# Altium project LED_MAT_3.PRJPCB (part 1 of 2)
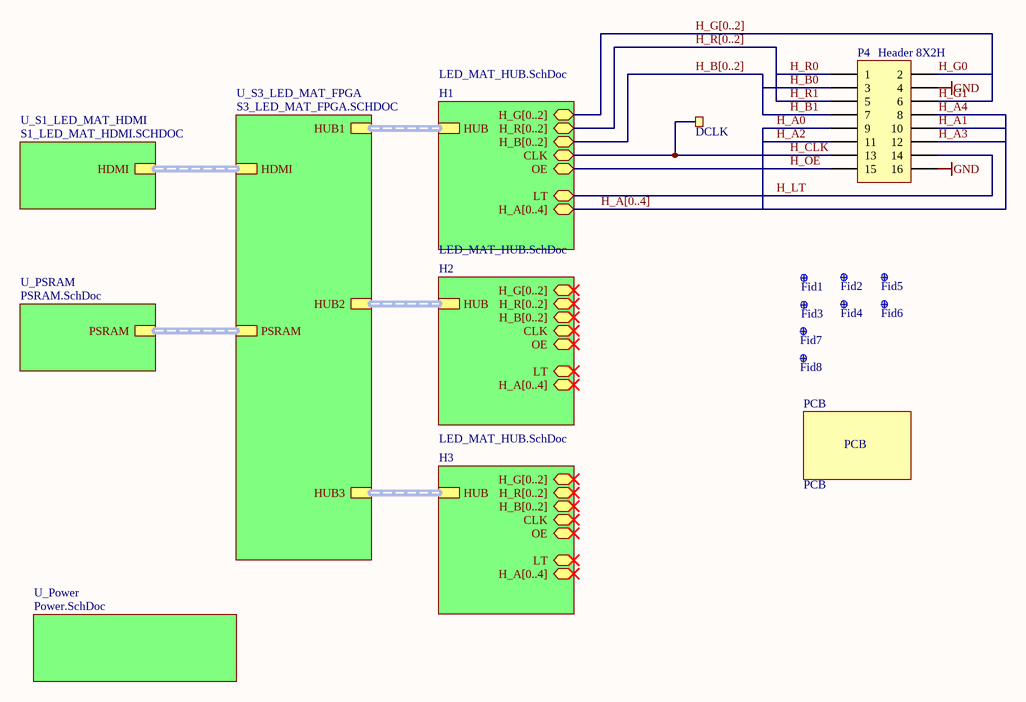
[diagram p0: Top.SchDoc]
ProjectName: LED_MAT3; Revision: 2.0
7 sheets, 230 parts. Net scope: hierarchical (ports join the sheet entries above them; power ports are global).
Board files: LED_MAT.PcbDoc, Panel for LED_MAT-20180829-1100.PcbDoc
Sheets:
  Top.SchDoc
    H1 = LED_MAT_HUB.SchDoc
    U_S3_LED_MAT_FPGA = S3_LED_MAT_FPGA.SCHDOC
      U_S3_LED_MAT_FPGA_POWER = S3_LED_MAT_FPGA_POWER.SchDoc
    U_S1_LED_MAT_HDMI = S1_LED_MAT_HDMI.SCHDOC
    H2 = LED_MAT_HUB.SchDoc
    H3 = LED_MAT_HUB.SchDoc
    U_Power = Power.SchDoc
    U_PSRAM = PSRAM.SchDoc

## Sheet Top.SchDoc: Top Connections
size A4; Revision: 2.0; SheetNumber: 1; SheetTotal: 7; DrawnBy: KSN; Engineer: Dim Su; ContentRev1: Original Document; dateREV1: "Aug/08/2018"; NameRev1: V1; NameRev2: V2; dateREV2: "Sep/03/2018"; ContentRev2: Test pin added; Rev1: V1; Rev2: V2; Project: LED_MAT_3

### Parts
DCLK  Ø1.0mm,SMD  [TP_SMD_1MM]  (value not drawn)  (no BOM)
Fid1  Fiducial mark  [Pass-marke-02]  (value not drawn)  (no BOM)
Fid2  Fiducial mark  [Pass-marke-02]  (value not drawn)  (no BOM)
Fid3  Fiducial mark  [Pass-marke-02]  (value not drawn)  (no BOM)
Fid4  Fiducial mark  [Pass-marke-02]  (value not drawn)  (no BOM)
Fid5  Fiducial mark  [Pass-marke-02]  (value not drawn)  (no BOM)
Fid6  Fiducial mark  [Pass-marke-02]  (value not drawn)  (no BOM)
Fid7  Fiducial mark  [Pass-marke-02]  (value not drawn)  (no BOM)
Fid8  Fiducial mark  [Pass-marke-02]  (value not drawn)  (no BOM)
P4  Header 8X2H  [HDR2X8H]
PCB  PCB  (mechanical)

### Sub-sheets
H1 = LED_MAT_HUB.SchDoc: HUB (harness HUB), H_B[0..2] (bidir), H_G[0..2] (bidir), H_R[0..2] (bidir), H_A[0..4] (bidir), CLK (bidir), OE (bidir), LT (bidir)
H2 = LED_MAT_HUB.SchDoc: HUB (harness HUB), H_B[0..2] (bidir), H_G[0..2] (bidir), H_R[0..2] (bidir), H_A[0..4] (bidir), CLK (bidir), OE (bidir), LT (bidir)
H3 = LED_MAT_HUB.SchDoc: HUB (harness HUB), H_B[0..2] (bidir), H_G[0..2] (bidir), H_R[0..2] (bidir), H_A[0..4] (bidir), CLK (bidir), OE (bidir), LT (bidir)
U_Power = Power.SchDoc: no entries
U_PSRAM = PSRAM.SchDoc: PSRAM (harness PSRAM)
U_S1_LED_MAT_HDMI = S1_LED_MAT_HDMI.SCHDOC: HDMI (harness HDMI)
U_S3_LED_MAT_FPGA = S3_LED_MAT_FPGA.SCHDOC: HUB2 (harness HUB), HUB1 (harness HUB), HUB3 (harness HUB), HDMI (harness HDMI), PSRAM (harness PSRAM)

### Nets
GND: P4.4 P4.16
H_A0: P4.9
H_A1: P4.10
H_A2: P4.11
H_A3: P4.12
H_A4: P4.8
H_B0: P4.3
H_B1: P4.7
H_CLK: DCLK.1 P4.13 ; sheet H1/CLK
H_G0: P4.2
H_G1: P4.6
H_LT: P4.14 ; sheet H1/LT
H_OE: P4.15 ; sheet H1/OE
H_R0: P4.1
H_R1: P4.5

### Buses and harness runs
bus H_A[0..4] = sheet H1/H_A[0..4]
bus H_B[0..2] = sheet H1/H_B[0..2]
bus H_G[0..2] = sheet H1/H_G[0..2]
bus H_R[0..2] = sheet H1/H_R[0..2]
harness sheet H1/HUB = sheet U_S3_LED_MAT_FPGA/HUB1
harness sheet H2/HUB = sheet U_S3_LED_MAT_FPGA/HUB2
harness sheet H3/HUB = sheet U_S3_LED_MAT_FPGA/HUB3
harness sheet U_PSRAM/PSRAM = sheet U_S3_LED_MAT_FPGA/PSRAM
harness sheet U_S1_LED_MAT_HDMI/HDMI = sheet U_S3_LED_MAT_FPGA/HDMI

### Notes on the sheet
- Title
- Size:
- Date:
- A4
- Number:
- Time:
- Revision:
- Sheet
- of
- File:

### Library data of the parts
DCLK = TESTPAD_SMD: circular SMD testpad 1mm; Manufacturer Part Number: *; Value: Ø1.0mm,SMD; Supplier: *; Category: Pattern
Fid1-Fid8 = Fiducial: Value: FM; Remarks: Pattern; Manufacturer: *; Manufacturer Part Number: *; Supplier: *; Category: Pattern; Price: 0; Temperature: ./.
P4 = Header 8X2H: Header, 8-Pin, Dual row, Right Angle; CompName: Connector; Price: .5
PCB = PCB: PNEC_Bridge_v1 PCB/FR4/1.55mm/8L/ENIG; Manufacturer: ./.; Value: 70x127.5x1.6mm 6 Layers; Category: PCB; Manufacturer Part Number: ./.; Package: 70x127.5x1.6mm 6 Layers; Price: 60; Remarks: ./.; Supplier: ./.; Supplier Order Code: ./.; Temperature: ./.; Tolerance: ./.; Type: 70x127.5x1.6mm 6 Layers; Voltage: ./.

## Sheet LED_MAT_HUB.SchDoc: HUB
size A4; Revision: 2.0; SheetNumber: 5; SheetTotal: 7; Engineer: Dim Su; ContentRev1: Original Document; dateREV1: "Aug/08/2018"; dateREV2: "Sep/03/2018"; ContentRev2: No changes; Rev1: V1; Rev2: V2; Project: LED_MAT_3
Used 3 times, as channels H1, H2, H3. Parts and nets are listed once, with the designators drawn on the sheet.
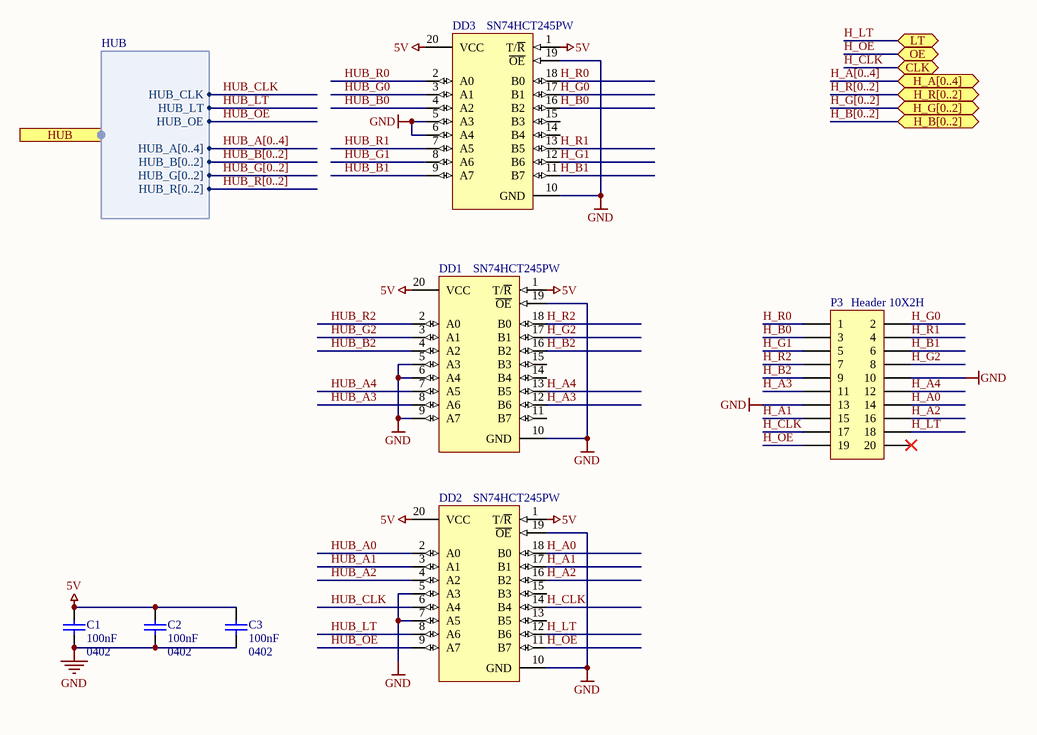
[diagram p1: LED_MAT_HUB.SchDoc]

### Parts
C1  value 100nF  Package: 0402  [CAPC1005L]  (hidden comment: 100nF / 0402 / X7R / 16V)
C2  value 100nF  Package: 0402  [CAPC1005L]  (hidden comment: 100nF / 0402 / X7R / 16V)
C3  value 100nF  Package: 0402  [CAPC1005L]  (hidden comment: 100nF / 0402 / X7R / 16V)
DD1  SN74HCT245PW  [PW020_N]
DD2  SN74HCT245PW  [PW020_N]
DD3  SN74HCT245PW  [PW020_N]
P3  Header 10X2H  [HDR2X10H]

### Ports
CLK (bidir), H_A[0..4] (bidir), H_B[0..2] (bidir), H_G[0..2] (bidir), H_R[0..2] (bidir), HUB (harness HUB), LT (bidir), OE (bidir)

### Harnesses
HUB: HUB_R[0..2], HUB_G[0..2], HUB_B[0..2], HUB_A[0..4], HUB_OE, HUB_LT, HUB_CLK

### Nets
5V: C1.2 C2.2 C3.2 DD1.1(T/~{R}) DD1.20(VCC) DD2.1(T/~{R}) DD2.20(VCC) DD3.1(T/~{R}) DD3.20(VCC)
GND: C1.1 C2.1 C3.1 DD1.5(A3) DD1.6(A4) DD1.9(A7) DD1.10(GND) DD1.19(~{OE}) DD2.5(A3) DD2.7(A5) DD2.10(GND) DD2.19(~{OE}) DD3.5(A3) DD3.6(A4) DD3.10(GND) DD3.19(~{OE}) P3.10 P3.13
H_A0: DD2.18(B0) P3.14
H_A1: DD2.17(B1) P3.15
H_A2: DD2.16(B2) P3.16
H_A3: DD1.12(B6) P3.11
H_A4: DD1.13(B5) P3.12
H_B0: DD3.16(B2) P3.3
H_B1: DD3.11(B7) P3.6
H_B2: DD1.16(B2) P3.9
H_CLK: DD2.14(B4) P3.17 ; port CLK
H_G0: DD3.17(B1) P3.2
H_G1: DD3.12(B6) P3.5
H_G2: DD1.17(B1) P3.8
H_LT: DD2.12(B6) P3.18 ; port LT
H_OE: DD2.11(B7) P3.19 ; port OE
H_R0: DD3.18(B0) P3.1
H_R1: DD3.13(B5) P3.4
H_R2: DD1.18(B0) P3.7
HUB_A0: DD2.2(A0)
HUB_A1: DD2.3(A1)
HUB_A2: DD2.4(A2)
HUB_A3: DD1.8(A6)
HUB_A4: DD1.7(A5)
HUB_B0: DD3.4(A2)
HUB_B1: DD3.9(A7)
HUB_B2: DD1.4(A2)
HUB_CLK: DD2.6(A4) ; port HUB.HUB_CLK
HUB_G0: DD3.3(A1)
HUB_G1: DD3.8(A6)
HUB_G2: DD1.3(A1)
HUB_LT: DD2.8(A6) ; port HUB.HUB_LT
HUB_OE: DD2.9(A7) ; port HUB.HUB_OE
HUB_R0: DD3.2(A0)
HUB_R1: DD3.7(A5)
HUB_R2: DD1.2(A0)

Not connected (* = marked no-connect by the designer): DD1 11(B7) 14(B4) 15(B3); DD2 13(B5) 15(B3); DD3 14(B4) 15(B3); P3 20*

### Channels
H1: designators end in _1; ports CLK=H_CLK LT=H_LT OE=H_OE
H2: designators end in _2; ports CLK=H_CLK_H2 LT=H_LT_H2 OE=H_OE_H2
H3: designators end in _3; ports CLK=H_CLK_H3 LT=H_LT_H3 OE=H_OE_H3

### Buses and harness runs
bus H_A[0..4] = port H_A[0..4]
bus H_B[0..2] = port H_B[0..2]
bus H_G[0..2] = port H_G[0..2]
bus H_R[0..2] = port H_R[0..2]
bus HUB_A[0..4]
bus HUB_B[0..2]
bus HUB_G[0..2]
bus HUB_R[0..2]

### Notes on the sheet
- Title
- Size:
- Date:
- A4
- Number:
- Time:
- Revision:
- Sheet
- of
- File:

### Library data of the parts
C1-C3 = 100nF / 0402 / X7R / 16V: Capacitor ceramic; Manufacturer: SAMSUNG; Manufacturer Part Number: CL05B104KO5NNNC; Voltage: 16V; CompName: Capacitor; Price: 0.2
DD1-DD3 = SN74HCT245PW: Octal 3-State Noninverting Bus Transceiver; Manufacturer: NEXPERIA; CompName: IC; Temperature: -55°C - 125°C; Package: SO-20; Manufacturer Part Number: SN74HCT245PW; Price: 3.14
P3 = Header 10X2H: Header, 10-Pin, Dual row, Right Angle; CompName: Connector; Price: .5

## Sheet S3_LED_MAT_FPGA.SCHDOC: FPGA
size A2; Date: "Day, Month  DD, YYYY"; DrawnBy: KSN; Engineer: Dim Su; Revision: 2.0; SheetNumber: 3; SheetTotal: 7; ContentRev1: Original Document; dateREV1: "Aug/08/2018"; dateREV2: "Sep/03/2018"; ContentRev2: C30, SW1 added; Rev1: V1; Rev2: V2; Project: LED_MAT_3
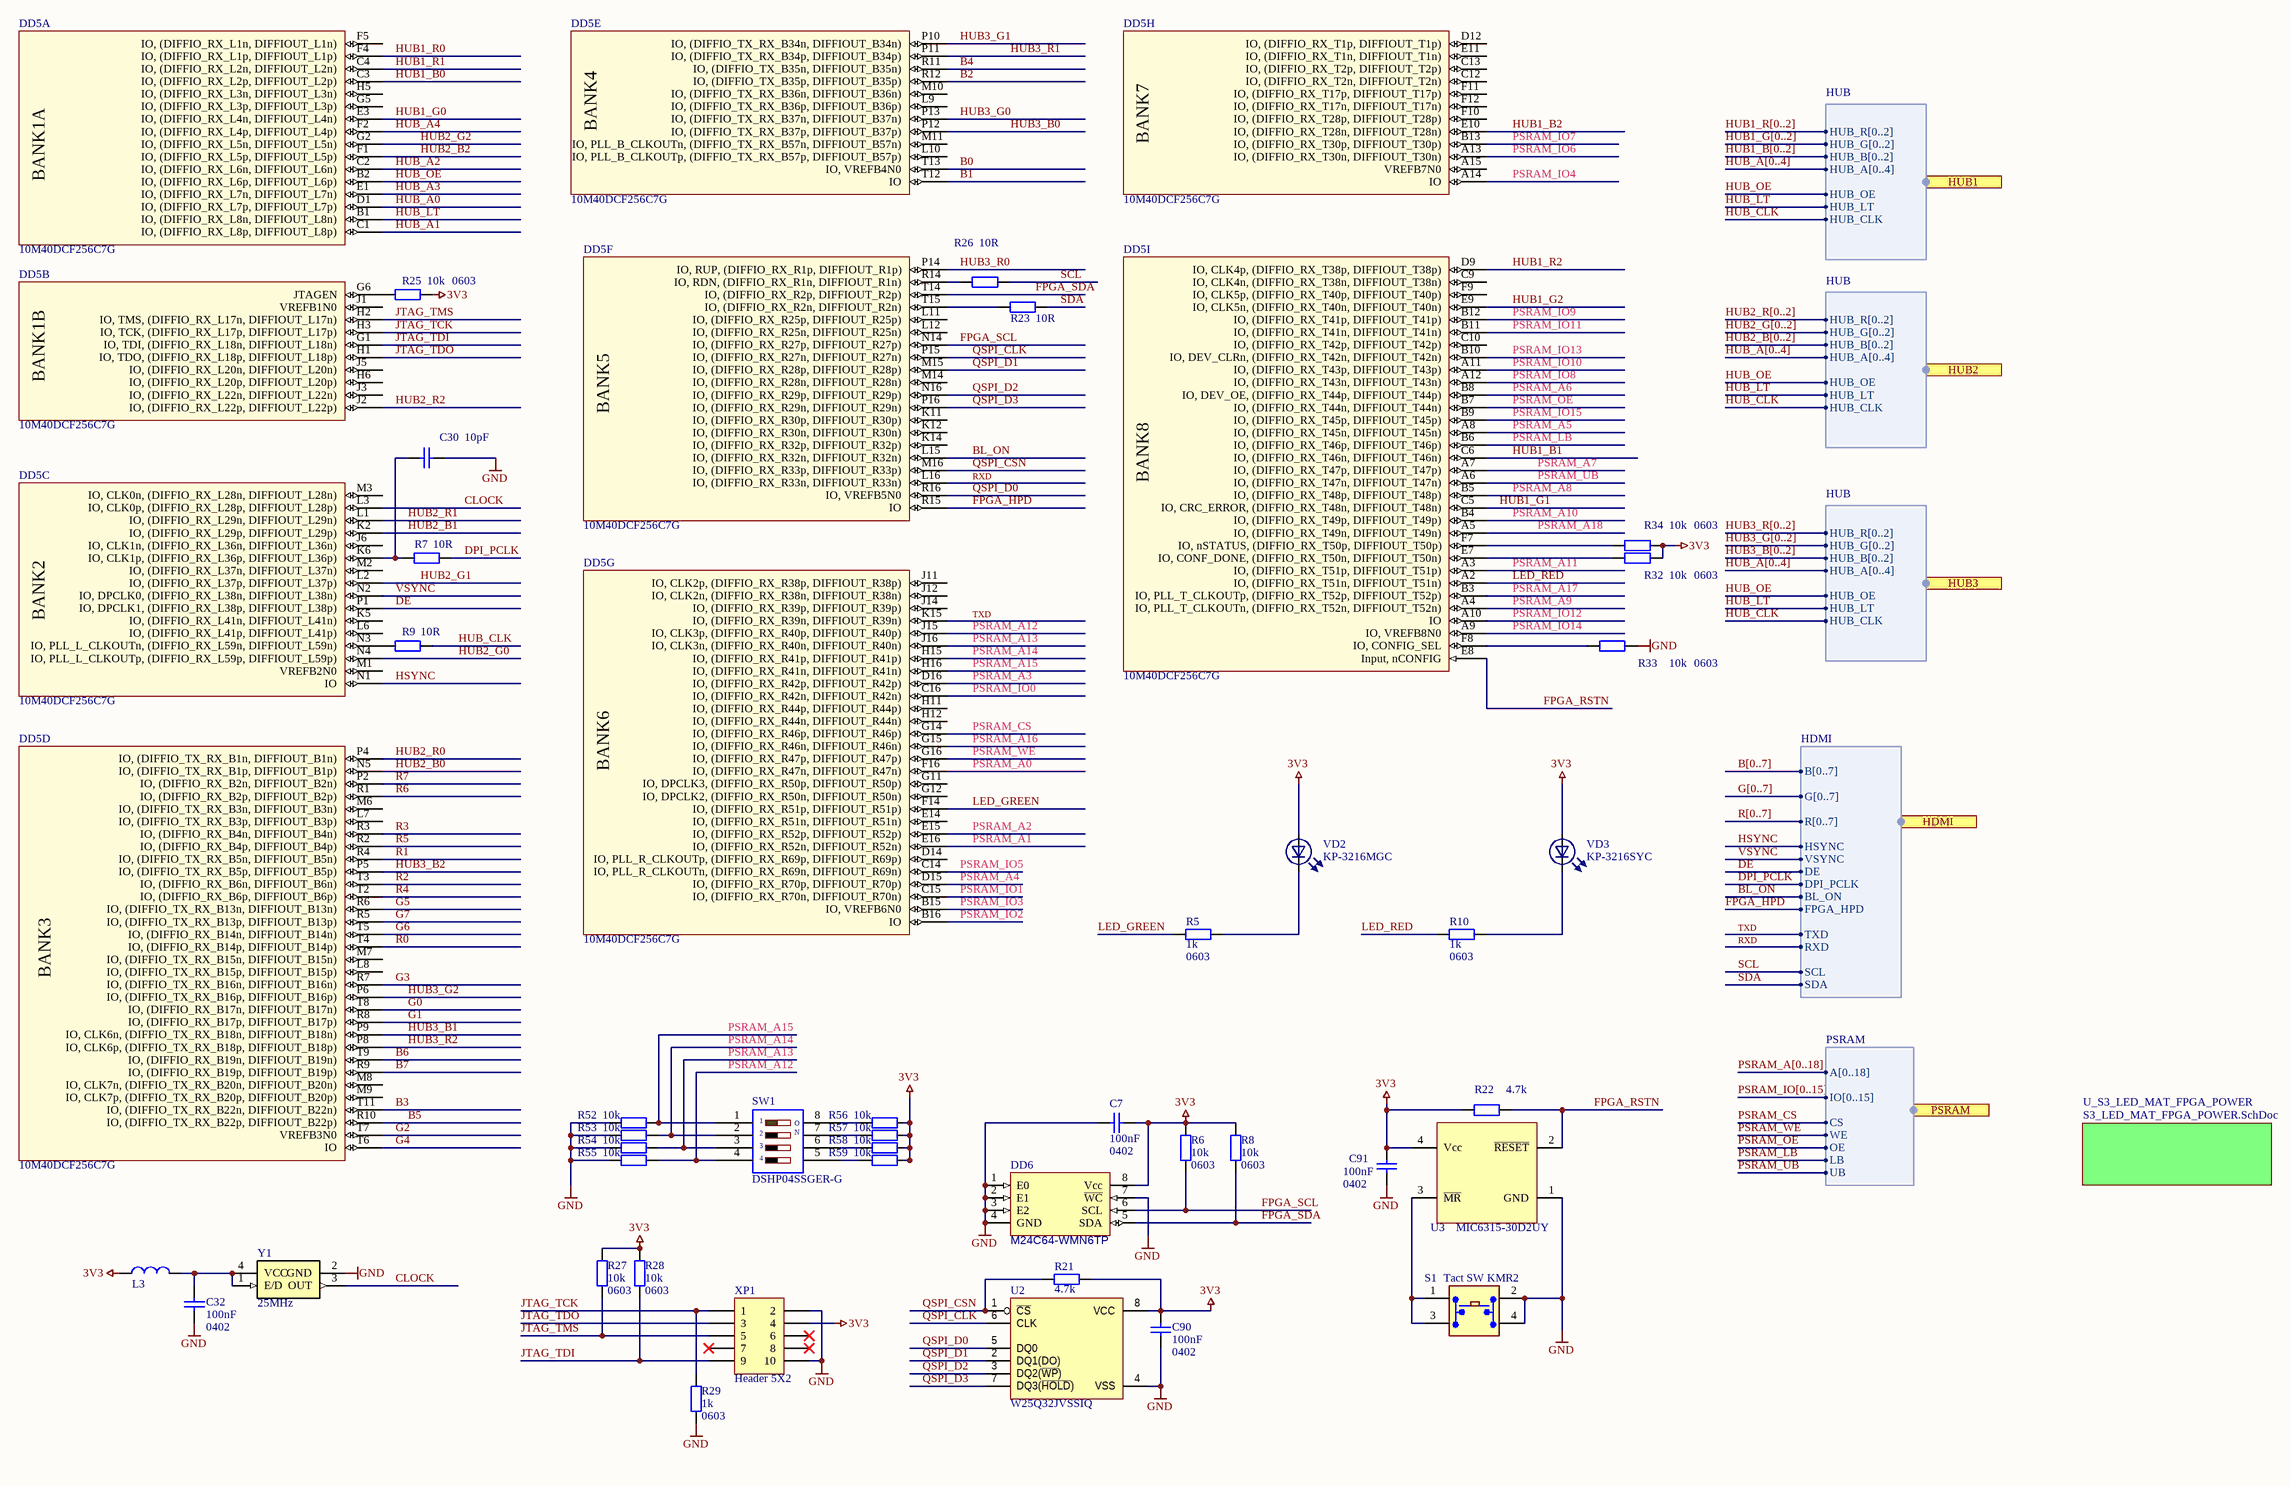
[diagram p2: S3_LED_MAT_FPGA.SCHDOC]

### Parts
C7  value 100nF  Package: 0402  [CAPC1005L]  (hidden comment: 100nF / 0402 / X7R / 16V)
C30  value 10pF  [CAPC1608L]  (hidden comment: 10pF / 0603 / COG / 50V)
C32  value 100nF  Package: 0402  [CAPC1005L]  (hidden comment: 100nF / 0402 / X7R / 16V)
C90  value 100nF  Package: 0402  [CAPC1005L]  (hidden comment: 100nF / 0402 / X7R / 16V)
C91  value 100nF  Package: 0402  [CAPC1005L]  (hidden comment: 100nF / 0402 / X7R / 16V)
DD5  10M40DCF256C7G  [BGA100P16X16-256]  (parts A,B,C,D,E,F,G,H,I of 11)
DD6  M24C64-WMN6TP  [SOIC127P600-8N]
L3  (no value)  [INDC1005L]
R5  value 1k  Package: 0603  [RESC1608L]  (hidden comment: 1k / 1% / 0603 / TC100 / 50V / 0.1W)
R6  value 10k  Package: 0603  [RESC1608L]  (hidden comment: 10k / 1% / 0603 / TC100 / 50V / 0.1W)
R7  value 10R  [RESC1608L]  (hidden comment: 10R / 1% / 0603)
R8  value 10k  Package: 0603  [RESC1608L]  (hidden comment: 10k / 1% / 0603 / TC100 / 50V / 0.1W)
R9  value 10R  [RESC1608L]  (hidden comment: 10R / 1% / 0603)
R10  value 1k  Package: 0603  [RESC1608L]  (hidden comment: 1k / 1% / 0603 / TC100 / 50V / 0.1W)
R21  value 4.7k  [RESC1608L]  (hidden comment: 4.7k / 1% / 0603)
R22  value 4.7k  [RESC1608L]  (hidden comment: 4.7k / 1% / 0603)
R23  value 10R  [RESC1608L]  (hidden comment: 10R / 1% / 0603)
R25  value 10k  Package: 0603  [RESC1608L]  (hidden comment: 10k / 1% / 0603 / TC100 / 50V / 0.1W)
R26  value 10R  [RESC1608L]  (hidden comment: 10R / 1% / 0603)
R27  value 10k  Package: 0603  [RESC1608L]  (hidden comment: 10k / 1% / 0603 / TC100 / 50V / 0.1W)
R28  value 10k  Package: 0603  [RESC1608L]  (hidden comment: 10k / 1% / 0603 / TC100 / 50V / 0.1W)
R29  value 1k  Package: 0603  [RESC1608L]  (hidden comment: 1k / 1% / 0603 / TC100 / 50V / 0.1W)
R32  value 10k  Package: 0603  [RESC1608L]  (hidden comment: 10k / 1% / 0603 / TC100 / 50V / 0.1W)
R33  value 10k  Package: 0603  [RESC1608L]  (hidden comment: 10k / 1% / 0603 / TC100 / 50V / 0.1W)
R34  value 10k  Package: 0603  [RESC1608L]  (hidden comment: 10k / 1% / 0603 / TC100 / 50V / 0.1W)
R52  value 10k  [RESC1608L]  (hidden comment: 10k / 1% / 0603 / TC100 / 50V / 0.1W)
R53  value 10k  [RESC1608L]  (hidden comment: 10k / 1% / 0603 / TC100 / 50V / 0.1W)
R54  value 10k  [RESC1608L]  (hidden comment: 10k / 1% / 0603 / TC100 / 50V / 0.1W)
R55  value 10k  [RESC1608L]  (hidden comment: 10k / 1% / 0603 / TC100 / 50V / 0.1W)
R56  value 10k  [RESC1608L]  (hidden comment: 10k / 1% / 0603 / TC100 / 50V / 0.1W)
R57  value 10k  [RESC1608L]  (hidden comment: 10k / 1% / 0603 / TC100 / 50V / 0.1W)
R58  value 10k  [RESC1608L]  (hidden comment: 10k / 1% / 0603 / TC100 / 50V / 0.1W)
R59  value 10k  [RESC1608L]  (hidden comment: 10k / 1% / 0603 / TC100 / 50V / 0.1W)
S1  Tact SW KMR2  [SW4SMD_63X161LS]
SW1  value DSHP04SSGER-G  [Dipswitch 4 SO8 a]  (hidden comment: DIP SW 4pol, 1.27mm)
U2  W25Q32JVSSIQ  [SOIC127P800X216-8L]
U3  value MIC6315-30D2UY  [SOT-143]  (hidden comment: MIC6315)
VD2  KP-3216MGC  [LED3216X10L]
VD3  KP-3216SYC  [LED3216X10L]
XP1  Header 5X2  [PLD10]
Y1  25MHz  [SMD03025/4CC]

### Sub-sheets
U_S3_LED_MAT_FPGA_POWER = S3_LED_MAT_FPGA_POWER.SchDoc: no entries

### Ports
HDMI (harness HDMI), HUB1 (harness HUB), HUB2 (harness HUB), HUB3 (harness HUB), PSRAM (harness PSRAM)

### Harnesses
HUB: HUB_R[0..2], HUB_G[0..2], HUB_B[0..2], HUB_A[0..4], HUB_OE, HUB_LT, HUB_CLK
HDMI: B[0..7], G[0..7], R[0..7], HSYNC, VSYNC, DE, DPI_PCLK, BL_ON, TXD, RXD, SCL, SDA, FPGA_HPD
PSRAM: A[0..18], IO[0..15], CS, WE, OE, LB, UB

### Nets
3V3: C7.1 C90.2 C91.2 DD6.8(Vcc) L3.1 R6.2 R8.1 R21.2 R22.1 R25.1 R27.1 R28.1 R32.1 R34.1 R56.1 R57.1 R58.1 R59.1 U2.8(VCC) U3.4(Vcc) VD2.1 VD3.1 XP1.4
GND: C7.2 C30.1 C32.1 C90.1 C91.1 DD6.1(E0) DD6.2(E1) DD6.3(E2) DD6.4(GND) DD6.7(~{WC}) R29.2 R33.1 R52.2 R53.2 R54.2 R55.2 S1.2(A2) S1.4 U2.4(VSS) U3.1(GND) XP1.2 XP1.10 Y1.2(GND)
B0: DD5.T13(IO,_VREFB4N0)
B1: DD5.T12(IO)
B2: DD5.R12(IO,_(DIFFIO_TX_B35p,_DIFFIOUT_B35p))
B3: DD5.T11(IO,_(DIFFIO_TX_RX_B22n,_DIFFIOUT_B22n))
B4: DD5.R11(IO,_(DIFFIO_TX_B35n,_DIFFIOUT_B35n))
B5: DD5.R10(IO,_(DIFFIO_TX_RX_B22p,_DIFFIOUT_B22p))
B6: DD5.T9(IO,_(DIFFIO_RX_B19n,_DIFFIOUT_B19n))
B7: DD5.R9(IO,_(DIFFIO_RX_B19p,_DIFFIOUT_B19p))
BL_ON: DD5.L15(IO,_(DIFFIO_RX_R32n,_DIFFIOUT_R32n)) ; port HDMI.BL_ON
CLOCK: DD5.L3(IO,_CLK0p,_(DIFFIO_RX_L28p,_DIFFIOUT_L28p)) Y1.3(OUT)
DE: DD5.P1(IO,_DPCLK1,_(DIFFIO_RX_L38p,_DIFFIOUT_L38p)) ; port HDMI.DE
DPI_PCLK: R7.1 ; port HDMI.DPI_PCLK
FPGA_HPD: DD5.R15(IO) ; port HDMI.FPGA_HPD
FPGA_RSTN: DD5.E8(Input,_nCONFIG) R22.2 U3.2(~{RESET})
FPGA_SCL: DD5.N14(IO,_(DIFFIO_RX_R27p,_DIFFIOUT_R27p)) DD6.6(SCL) R6.1
FPGA_SDA: DD5.T14(IO,_(DIFFIO_RX_R2p,_DIFFIOUT_R2p)) DD6.5(SDA) R8.2
G0: DD5.T8(IO,_(DIFFIO_RX_B17n,_DIFFIOUT_B17n))
G1: DD5.R8(IO,_(DIFFIO_RX_B17p,_DIFFIOUT_B17p))
G2: DD5.T7(VREFB3N0)
G3: DD5.R7(IO,_(DIFFIO_TX_RX_B16n,_DIFFIOUT_B16n))
G4: DD5.T6(IO)
G5: DD5.R6(IO,_(DIFFIO_TX_RX_B13n,_DIFFIOUT_B13n))
G6: DD5.T5(IO,_(DIFFIO_RX_B14n,_DIFFIOUT_B14n))
G7: DD5.R5(IO,_(DIFFIO_TX_RX_B13p,_DIFFIOUT_B13p))
HSYNC: DD5.N1(IO) ; port HDMI.HSYNC
HUB1_B0: DD5.C3(IO,_(DIFFIO_RX_L2p,_DIFFIOUT_L2p))
HUB1_B1: DD5.C6(IO,_(DIFFIO_RX_T46n,_DIFFIOUT_T46n))
HUB1_B2: DD5.E10(IO,_(DIFFIO_RX_T28n,_DIFFIOUT_T28n))
HUB1_G0: DD5.E3(IO,_(DIFFIO_RX_L4n,_DIFFIOUT_L4n))
HUB1_G1: DD5.C5(IO,_CRC_ERROR,_(DIFFIO_RX_T48n,_DIFFIOUT_T48n))
HUB1_G2: DD5.E9(IO,_CLK5n,_(DIFFIO_RX_T40n,_DIFFIOUT_T40n))
HUB1_R0: DD5.F4(IO,_(DIFFIO_RX_L1p,_DIFFIOUT_L1p))
HUB1_R1: DD5.C4(IO,_(DIFFIO_RX_L2n,_DIFFIOUT_L2n))
HUB1_R2: DD5.D9(IO,_CLK4p,_(DIFFIO_RX_T38p,_DIFFIOUT_T38p))
HUB2_B0: DD5.N5(IO,_(DIFFIO_TX_RX_B1p,_DIFFIOUT_B1p))
HUB2_B1: DD5.K2(IO,_(DIFFIO_RX_L29p,_DIFFIOUT_L29p))
HUB2_B2: DD5.F1(IO,_(DIFFIO_RX_L5p,_DIFFIOUT_L5p))
HUB2_G0: DD5.N4(IO,_PLL_L_CLKOUTp,_(DIFFIO_RX_L59p,_DIFFIOUT_L59p))
HUB2_G1: DD5.L2(IO,_(DIFFIO_RX_L37p,_DIFFIOUT_L37p))
HUB2_G2: DD5.G2(IO,_(DIFFIO_RX_L5n,_DIFFIOUT_L5n))
HUB2_R0: DD5.P4(IO,_(DIFFIO_TX_RX_B1n,_DIFFIOUT_B1n))
HUB2_R1: DD5.L1(IO,_(DIFFIO_RX_L29n,_DIFFIOUT_L29n))
HUB2_R2: DD5.J2(IO,_(DIFFIO_RX_L22p,_DIFFIOUT_L22p))
HUB3_B0: DD5.P12(IO,_(DIFFIO_TX_RX_B37p,_DIFFIOUT_B37p))
HUB3_B1: DD5.P9(IO,_CLK6n,_(DIFFIO_TX_RX_B18n,_DIFFIOUT_B18n))
HUB3_B2: DD5.P5(IO,_(DIFFIO_TX_RX_B5p,_DIFFIOUT_B5p))
HUB3_G0: DD5.P13(IO,_(DIFFIO_TX_RX_B37n,_DIFFIOUT_B37n))
HUB3_G1: DD5.P10(IO,_(DIFFIO_TX_RX_B34n,_DIFFIOUT_B34n))
HUB3_G2: DD5.P6(IO,_(DIFFIO_TX_RX_B16p,_DIFFIOUT_B16p))
HUB3_R0: DD5.P14(IO,_RUP,_(DIFFIO_RX_R1p,_DIFFIOUT_R1p))
HUB3_R1: DD5.P11(IO,_(DIFFIO_TX_RX_B34p,_DIFFIOUT_B34p))
HUB3_R2: DD5.P8(IO,_CLK6p,_(DIFFIO_TX_RX_B18p,_DIFFIOUT_B18p))
HUB_A0: DD5.D1(IO,_(DIFFIO_RX_L7p,_DIFFIOUT_L7p))
HUB_A1: DD5.C1(IO,_(DIFFIO_RX_L8p,_DIFFIOUT_L8p))
HUB_A2: DD5.C2(IO,_(DIFFIO_RX_L6n,_DIFFIOUT_L6n))
HUB_A3: DD5.E1(IO,_(DIFFIO_RX_L7n,_DIFFIOUT_L7n))
HUB_A4: DD5.F2(IO,_(DIFFIO_RX_L4p,_DIFFIOUT_L4p))
HUB_CLK: R9.1 ; port HUB2.HUB_CLK, port HUB1.HUB_CLK, port HUB3.HUB_CLK
HUB_LT: DD5.B1(IO,_(DIFFIO_RX_L8n,_DIFFIOUT_L8n)) ; port HUB2.HUB_LT, port HUB1.HUB_LT, port HUB3.HUB_LT
HUB_OE: DD5.B2(IO,_(DIFFIO_RX_L6p,_DIFFIOUT_L6p)) ; port HUB2.HUB_OE, port HUB1.HUB_OE, port HUB3.HUB_OE
JTAG_TCK: DD5.H3(IO,_TCK,_(DIFFIO_RX_L17p,_DIFFIOUT_L17p)) R29.1 XP1.1
JTAG_TDI: DD5.G1(IO,_TDI,_(DIFFIO_RX_L18n,_DIFFIOUT_L18n)) R28.2 XP1.9
JTAG_TDO: DD5.H1(IO,_TDO,_(DIFFIO_RX_L18p,_DIFFIOUT_L18p)) XP1.3
JTAG_TMS: DD5.H2(IO,_TMS,_(DIFFIO_RX_L17n,_DIFFIOUT_L17n)) R27.2 XP1.5
LED_GREEN: DD5.F14(IO,_(DIFFIO_RX_R51p,_DIFFIOUT_R51p)) R5.2
LED_RED: DD5.A2(IO,_(DIFFIO_RX_T51n,_DIFFIOUT_T51n)) R10.2
PSRAM_A0: DD5.F16(IO,_(DIFFIO_RX_R47n,_DIFFIOUT_R47n))  [project net A0]
PSRAM_A1: DD5.E16(IO,_(DIFFIO_RX_R52n,_DIFFIOUT_R52n))  [project net A1]
PSRAM_A2: DD5.E15(IO,_(DIFFIO_RX_R52p,_DIFFIOUT_R52p))  [project net A2]
PSRAM_A3: DD5.D16(IO,_(DIFFIO_RX_R42p,_DIFFIOUT_R42p))  [project net A3]
PSRAM_A4: DD5.D15(IO,_(DIFFIO_RX_R70p,_DIFFIOUT_R70p))  [project net A4]
PSRAM_A5: DD5.A8(IO,_(DIFFIO_RX_T45n,_DIFFIOUT_T45n))  [project net A5]
PSRAM_A6: DD5.B8(IO,_DEV_OE,_(DIFFIO_RX_T44p,_DIFFIOUT_T44p))  [project net A6]
PSRAM_A7: DD5.A7(IO,_(DIFFIO_RX_T47p,_DIFFIOUT_T47p))  [project net A7]
PSRAM_A8: DD5.B5(IO,_(DIFFIO_RX_T48p,_DIFFIOUT_T48p))  [project net A8]
PSRAM_A9: DD5.A4(IO,_PLL_T_CLKOUTn,_(DIFFIO_RX_T52n,_DIFFIOUT_T52n))  [project net A9]
PSRAM_A10: DD5.B4(IO,_(DIFFIO_RX_T49p,_DIFFIOUT_T49p))  [project net A10]
PSRAM_A11: DD5.A3(IO,_(DIFFIO_RX_T51p,_DIFFIOUT_T51p))  [project net A11]
PSRAM_A12: DD5.J15(IO,_CLK3p,_(DIFFIO_RX_R40p,_DIFFIOUT_R40p)) R55.1 SW1.4  [project net A12]
PSRAM_A13: DD5.J16(IO,_CLK3n,_(DIFFIO_RX_R40n,_DIFFIOUT_R40n)) R54.1 SW1.3  [project net A13]
PSRAM_A14: DD5.H15(IO,_(DIFFIO_RX_R41p,_DIFFIOUT_R41p)) R53.1 SW1.2  [project net A14]
PSRAM_A15: DD5.H16(IO,_(DIFFIO_RX_R41n,_DIFFIOUT_R41n)) R52.1 SW1.1  [project net A15]
PSRAM_A16: DD5.G15(IO,_(DIFFIO_RX_R46n,_DIFFIOUT_R46n))  [project net A16]
PSRAM_A17: DD5.B3(IO,_PLL_T_CLKOUTp,_(DIFFIO_RX_T52p,_DIFFIOUT_T52p))  [project net A17]
PSRAM_A18: DD5.A5(IO,_(DIFFIO_RX_T49n,_DIFFIOUT_T49n))  [project net A18]
PSRAM_CS: DD5.G14(IO,_(DIFFIO_RX_R46p,_DIFFIOUT_R46p)) ; port PSRAM.CS  [project net CS]
PSRAM_IO0: DD5.C16(IO,_(DIFFIO_RX_R42n,_DIFFIOUT_R42n))  [project net IO0]
PSRAM_IO1: DD5.C15(IO,_(DIFFIO_RX_R70n,_DIFFIOUT_R70n))  [project net IO1]
PSRAM_IO2: DD5.B16(IO)  [project net IO2]
PSRAM_IO3: DD5.B15(IO,_VREFB6N0)  [project net IO3]
PSRAM_IO4: DD5.A14(IO)  [project net IO4]
PSRAM_IO5: DD5.C14(IO,_PLL_R_CLKOUTn,_(DIFFIO_RX_R69n,_DIFFIOUT_R69n))  [project net IO5]
PSRAM_IO6: DD5.A13(IO,_(DIFFIO_RX_T30n,_DIFFIOUT_T30n))  [project net IO6]
PSRAM_IO7: DD5.B13(IO,_(DIFFIO_RX_T30p,_DIFFIOUT_T30p))  [project net IO7]
PSRAM_IO8: DD5.A12(IO,_(DIFFIO_RX_T43n,_DIFFIOUT_T43n))  [project net IO8]
PSRAM_IO9: DD5.B12(IO,_(DIFFIO_RX_T41p,_DIFFIOUT_T41p))  [project net IO9]
PSRAM_IO10: DD5.A11(IO,_(DIFFIO_RX_T43p,_DIFFIOUT_T43p))  [project net IO10]
PSRAM_IO11: DD5.B11(IO,_(DIFFIO_RX_T41n,_DIFFIOUT_T41n))  [project net IO11]
PSRAM_IO12: DD5.A10(IO)  [project net IO12]
PSRAM_IO13: DD5.B10(IO,_DEV_CLRn,_(DIFFIO_RX_T42n,_DIFFIOUT_T42n))  [project net IO13]
PSRAM_IO14: DD5.A9(IO,_VREFB8N0)  [project net IO14]
PSRAM_IO15: DD5.B9(IO,_(DIFFIO_RX_T45p,_DIFFIOUT_T45p))  [project net IO15]
PSRAM_LB: DD5.B6(IO,_(DIFFIO_RX_T46p,_DIFFIOUT_T46p)) ; port PSRAM.LB  [project net LB]
PSRAM_OE: DD5.B7(IO,_(DIFFIO_RX_T44n,_DIFFIOUT_T44n)) ; port PSRAM.OE  [project net OE]
PSRAM_UB: DD5.A6(IO,_(DIFFIO_RX_T47n,_DIFFIOUT_T47n)) ; port PSRAM.UB
PSRAM_WE: DD5.G16(IO,_(DIFFIO_RX_R47p,_DIFFIOUT_R47p)) ; port PSRAM.WE
QSPI_CLK: DD5.P15(IO,_(DIFFIO_RX_R27n,_DIFFIOUT_R27n)) U2.6(CLK)
QSPI_CSN: DD5.M16(IO,_(DIFFIO_RX_R33p,_DIFFIOUT_R33p)) R21.1 U2.1(~{CS})
QSPI_D0: DD5.R16(IO,_VREFB5N0) U2.5(DQ0)
QSPI_D1: DD5.M15(IO,_(DIFFIO_RX_R28p,_DIFFIOUT_R28p)) U2.2(DQ1(DO))
QSPI_D2: DD5.N16(IO,_(DIFFIO_RX_R29p,_DIFFIOUT_R29p)) U2.3(DQ2(~{WP}))
QSPI_D3: DD5.P16(IO,_(DIFFIO_RX_R29n,_DIFFIOUT_R29n)) U2.7(DQ3(~{HOLD}))
R0: DD5.T4(IO,_(DIFFIO_RX_B14p,_DIFFIOUT_B14p))
R1: DD5.R4(IO,_(DIFFIO_TX_RX_B5n,_DIFFIOUT_B5n))
R2: DD5.T3(IO,_(DIFFIO_RX_B6n,_DIFFIOUT_B6n))
R3: DD5.R3(IO,_(DIFFIO_RX_B4n,_DIFFIOUT_B4n))
R4: DD5.T2(IO,_(DIFFIO_RX_B6p,_DIFFIOUT_B6p))
R5: DD5.R2(IO,_(DIFFIO_RX_B4p,_DIFFIOUT_B4p))
R6: DD5.R1(IO,_(DIFFIO_RX_B2p,_DIFFIOUT_B2p))
R7: DD5.P2(IO,_(DIFFIO_RX_B2n,_DIFFIOUT_B2n))
RXD: DD5.L16(IO,_(DIFFIO_RX_R33n,_DIFFIOUT_R33n)) ; port HDMI.RXD
SCL: R26.1 ; port HDMI.SCL
SDA: R23.1 ; port HDMI.SDA
TXD: DD5.K15(IO,_(DIFFIO_RX_R39n,_DIFFIOUT_R39n)) ; port HDMI.TXD
VSYNC: DD5.N2(IO,_DPCLK0,_(DIFFIO_RX_L38n,_DIFFIOUT_L38n)) ; port HDMI.VSYNC
NetC30_2: C30.2 DD5.K6(IO,_CLK1p,_(DIFFIO_RX_L36p,_DIFFIOUT_L36p)) R7.2
NetC32_2: C32.2 L3.2 Y1.1(E/D) Y1.4(VCC)
NetDD5_E7: DD5.E7(IO,_CONF_DONE,_(DIFFIO_RX_T50n,_DIFFIOUT_T50n)) R32.2
NetDD5_F7: DD5.F7(IO,_nSTATUS,_(DIFFIO_RX_T50p,_DIFFIOUT_T50p)) R34.2
NetDD5_F8: DD5.F8(IO,_CONFIG_SEL) R33.2
NetDD5_G6: DD5.G6(JTAGEN) R25.2
NetDD5_N3: DD5.N3(IO,_PLL_L_CLKOUTn,_(DIFFIO_RX_L59n,_DIFFIOUT_L59n)) R9.2
NetDD5_R14: DD5.R14(IO,_RDN,_(DIFFIO_RX_R1n,_DIFFIOUT_R1n)) R26.2
NetDD5_T15: DD5.T15(IO,_(DIFFIO_RX_R2n,_DIFFIOUT_R2n)) R23.2
NetR5_1: R5.1 VD2.2
NetR10_1: R10.1 VD3.2
NetR56_2: R56.2 SW1.8
NetR57_2: R57.2 SW1.7
NetR58_2: R58.2 SW1.6
NetR59_2: R59.2 SW1.5
NetS1_1: S1.1(A1) S1.3(A3) U3.3(~{MR})

Not connected (* = marked no-connect by the designer): DD5 A15(VREFB7N0) C9(IO,_CLK4n,_(DIFFIO_RX_T38n,_DIFFIOUT_T38n)) C10(IO,_(DIFFIO_RX_T42p,_DIFFIOUT_T42p)) C12(IO,_(DIFFIO_RX_T2n,_DIFFIOUT_T2n)) C13(IO,_(DIFFIO_RX_T2p,_DIFFIOUT_T2p)) D12(IO,_(DIFFIO_RX_T1p,_DIFFIOUT_T1p)) D14(IO,_PLL_R_CLKOUTp,_(DIFFIO_RX_R69p,_DIFFIOUT_R69p)) E11(IO,_(DIFFIO_RX_T1n,_DIFFIOUT_T1n)) E14(IO,_(DIFFIO_RX_R51n,_DIFFIOUT_R51n)) F5(IO,_(DIFFIO_RX_L1n,_DIFFIOUT_L1n)) F9(IO,_CLK5p,_(DIFFIO_RX_T40p,_DIFFIOUT_T40p)) F10(IO,_(DIFFIO_RX_T28p,_DIFFIOUT_T28p)) F11(IO,_(DIFFIO_RX_T17p,_DIFFIOUT_T17p)) F12(IO,_(DIFFIO_RX_T17n,_DIFFIOUT_T17n)) G5(IO,_(DIFFIO_RX_L3p,_DIFFIOUT_L3p)) G11(IO,_DPCLK3,_(DIFFIO_RX_R50p,_DIFFIOUT_R50p)) G12(IO,_DPCLK2,_(DIFFIO_RX_R50n,_DIFFIOUT_R50n)) H5(IO,_(DIFFIO_RX_L3n,_DIFFIOUT_L3n)) H6(IO,_(DIFFIO_RX_L20p,_DIFFIOUT_L20p)) H11(IO,_(DIFFIO_RX_R44p,_DIFFIOUT_R44p)) H12(IO,_(DIFFIO_RX_R44n,_DIFFIOUT_R44n)) J1(VREFB1N0) J3(IO,_(DIFFIO_RX_L22n,_DIFFIOUT_L22n)) J5(IO,_(DIFFIO_RX_L20n,_DIFFIOUT_L20n)) J6(IO,_CLK1n,_(DIFFIO_RX_L36n,_DIFFIOUT_L36n)) J11(IO,_CLK2p,_(DIFFIO_RX_R38p,_DIFFIOUT_R38p)) J12(IO,_CLK2n,_(DIFFIO_RX_R38n,_DIFFIOUT_R38n)) J14(IO,_(DIFFIO_RX_R39p,_DIFFIOUT_R39p)) K5(IO,_(DIFFIO_RX_L41n,_DIFFIOUT_L41n)) K11(IO,_(DIFFIO_RX_R30p,_DIFFIOUT_R30p)) K12(IO,_(DIFFIO_RX_R30n,_DIFFIOUT_R30n)) K14(IO,_(DIFFIO_RX_R32p,_DIFFIOUT_R32p)) L6(IO,_(DIFFIO_RX_L41p,_DIFFIOUT_L41p)) L7(IO,_(DIFFIO_TX_RX_B3p,_DIFFIOUT_B3p)) L8(IO,_(DIFFIO_TX_RX_B15p,_DIFFIOUT_B15p)) L9(IO,_(DIFFIO_TX_RX_B36p,_DIFFIOUT_B36p)) L10(IO,_PLL_B_CLKOUTp,_(DIFFIO_TX_RX_B57p,_DIFFIOUT_B57p)) L11(IO,_(DIFFIO_RX_R25p,_DIFFIOUT_R25p)) L12(IO,_(DIFFIO_RX_R25n,_DIFFIOUT_R25n)) M1(VREFB2N0) M2(IO,_(DIFFIO_RX_L37n,_DIFFIOUT_L37n)) M3(IO,_CLK0n,_(DIFFIO_RX_L28n,_DIFFIOUT_L28n)) M6(IO,_(DIFFIO_TX_RX_B3n,_DIFFIOUT_B3n)) M7(IO,_(DIFFIO_TX_RX_B15n,_DIFFIOUT_B15n)) M8(IO,_CLK7n,_(DIFFIO_TX_RX_B20n,_DIFFIOUT_B20n)) M9(IO,_CLK7p,_(DIFFIO_TX_RX_B20p,_DIFFIOUT_B20p)) M10(IO,_(DIFFIO_TX_RX_B36n,_DIFFIOUT_B36n)) M11(IO,_PLL_B_CLKOUTn,_(DIFFIO_TX_RX_B57n,_DIFFIOUT_B57n)) M14(IO,_(DIFFIO_RX_R28n,_DIFFIOUT_R28n)); XP1 6* 7* 8*

### Buses and harness runs
bus B[0..7]
bus G[0..7]
bus HUB1_B[0..2]
bus HUB1_G[0..2]
bus HUB1_R[0..2]
bus HUB2_B[0..2]
bus HUB2_G[0..2]
bus HUB2_R[0..2]
bus HUB3_B[0..2]
bus HUB3_G[0..2]
bus HUB3_R[0..2]
bus HUB_A[0..4]
bus PSRAM_A[0..18]
bus PSRAM_IO[0..15]
bus R[0..7]

### Notes on the sheet
- Title
- Size:
- Date:
- File:
- A2
- Number:
- Time:
- Revision:
- Sheet
- of
- (in symbol 10M40DCF256C7G, part A) BANK1A
- (in symbol 10M40DCF256C7G, part B) BANK1B
- (in symbol 10M40DCF256C7G, part C) BANK2
- (in symbol 10M40DCF256C7G, part D) BANK3
- (in symbol 10M40DCF256C7G, part E) BANK4
- (in symbol 10M40DCF256C7G, part F) BANK5
- (in symbol 10M40DCF256C7G, part G) BANK6
- (in symbol 10M40DCF256C7G, part H) BANK7
- (in symbol 10M40DCF256C7G, part I) BANK8
- (in symbol DIP SW 4pol, 1.27mm) O; N

### Library data of the parts
C7 C32 C90 C91 = 100nF / 0402 / X7R / 16V: as C1 on sheet LED_MAT_HUB; Voltage: 16V; CompName: Capacitor; Price: 0.2
C30 = 10pF / 0603 / COG / 50V: Capacitor ceramic; Manufacturer: SAMSUNG; Manufacturer Part Number: CL10C100JB8NNNC; Tolerance: 5%; Package: 0603; Voltage: 50V; CompName: Capacitor; Category: Capacitor; Price: 0.2; Type: COG
DD5 = 10M40DCF256C7G: FPGA; CompName: IC; Manufacturer: ALTERA; Manufacturer Part Number: 10M40DCF256C7GA; CompKind: 0; CompType: 10M40DCF256C7G; ValueBOM: 10M40DCF256C7G; Package: BGA256; Price: 1800; Remarks: *; Supplier: ARROW
DD6 = M24C64-WDW6TP: Manufacturer: ST; CompName: IC; Remarks: ./.; Voltage: 3.0...5.5V; Category: I2C EEPROM; Package: SO8; Tolerance: ./.; Type: M24C64-WMN6TP; Manufacturer Part Number: M24C64-WMN6TP; Price: 7.02; Temperature: -40...+85°C; Value: M24C64-WMN6TP
L3 = L0402_BLM15: General 0402 - type Chip Inductor; Manufacturer: Murata; Manufacturer Part Number: BLM15AG601SN1; CompName: Inductor; Package: 0402; Price: 0.05
R5 R10 R29 = 1k / 1% / 0603 / TC100 / 50V / 0.1W: Resistor; Remarks: replaceable; Tolerance: 1%; Voltage: 50V; CompName: Resistor; Price: 0.02
R6 R8 R25 R27 R28 R32-R34 R52-R59 = 10k / 1% / 0603 / TC100 / 50V / 0.1W: Resistor; Tolerance: 1%; Voltage: 50V; CompName: Resistor; Price: 0.02
  R52-R59: Package: 0603
R7 R9 R23 R26 = 10R / 1% / 0603: Manufacturer: YAGEO; Manufacturer Part Number: RC0603FR-0710RL; CompName: Resistor; Remarks: replaceable; Tolerance: 1%; Category: Resistor; Price: 0.02; Supplier: ./.; Supplier Order Code: ./.; Temperature: -40...+85°C; Package: 0603
R21 R22 = 4.7k / 1% / 0603: Manufacturer: YAGEO; Manufacturer Part Number: RC0603FR-074K7L; CompName: Resistor; Remarks: replaceable; Tolerance: 1%; Category: Resistor; Price: 0.02; Supplier: ./.; Supplier Order Code: ./.; Temperature: -40...+85°C; Package: 0603
S1 = Tact SW KMR2: Microminiature Tact Switch for SMT; Manufacturer: C&K Components; Manufacturer Part Number: KMR211GLFS; Remarks: ./.; Value: KMR211GLFS; Category: Switch; Supplier: Digikey; Supplier Order Code: 401-1426-2-ND; Package: KMR211GLFS; Price: 4.71; Temperature: - 40 C + 125 C; Tolerance: ./.; Type: KMR211GLFS; Voltage: ./.
SW1 = DIP SW 4pol, 1.27mm: Manufacturer: SWITRONIC; Tolerance: 1%; Remarks: replaceable; Manufacturer Part Number: DSHP04SSGER-G; Category: Switch; Price: 13.08; Temperature: -40...+85°C; Package: SO-8
U2 = W25Q32JVSSIQ: 32Mbit Quad Serial Flash in SOIC W package; Manufacturer: WINBOND; CompName: IC; Tolerance: ./.; Voltage: 2.7...3.6V; Category: IC; Manufacturer Part Number: W25Q32JVSSIQ; Package: SO-8 WIDE; Price: 30; Remarks: W25Q32JVSSIQ; Supplier: ARROW; Supplier Order Code: W25Q32JVSSIQ; Temperature: -40...+85°C; Type: SO; Value: W25Q32JVSSIQ
U3 = MIC6315: 3V VOLTAGE SUPERVISOR; Manufacturer: MICROCHIP; CompName: IC; Remarks: Power Monitor IC; Voltage: 3.3V; Manufacturer Part Number: MIC6315-30D2UY; Package: SOT-143; Category: IC; Price: 12; Supplier: Mouser; Supplier Order Code: 998-MIC6315-30D2UYTR; Temperature: -40°C - 85°C
VD2 = KP-3216MGC: SMD LED GREEN; Manufacturer: KINGBRIGHT; CompName: LED; Manufacturer Part Number: KP-3216MGC; Package: 3216; Price: 3.5; Type: Green
VD3 = KP-3216SYC: SMD LED YELLOW; Manufacturer: KINGBRIGHT; CompName: LED; Manufacturer Part Number: KP-3216SYC; Package: 3216; Price: 4.34; Type: Yellow
XP1 = Header 5X2: Header, 5-Pin, Dual row; CompName: Connector; Manufacturer: FCI; Voltage: 50V; Price: .1; Type: Connector
Y1 = OSC / 3225 / 25M: SMD Oscillator with Stop Function; Manufacturer: YOKETANT; Manufacturer Part Number: SO3225-025000-FIE-BBA-A1; Tolerance: 25ppm; CompName: Oscillator; Value: 25MHz; Package: 3225; Price: 10

## Sheet S3_LED_MAT_FPGA_POWER.SchDoc: FPGA Power
size A3; Date: "Day, Month  DD, YYYY"; DrawnBy: KSN; Engineer: Dim Su; Revision: 2.0; SheetNumber: 4; SheetTotal: 7; ContentRev1: Original Document; dateREV1: "Aug/08/2018"; dateREV2: "Sep/03/2018"; ContentRev2: Changes to the power pins; Rev1: V1; Rev2: V2; Project: LED_MAT_3
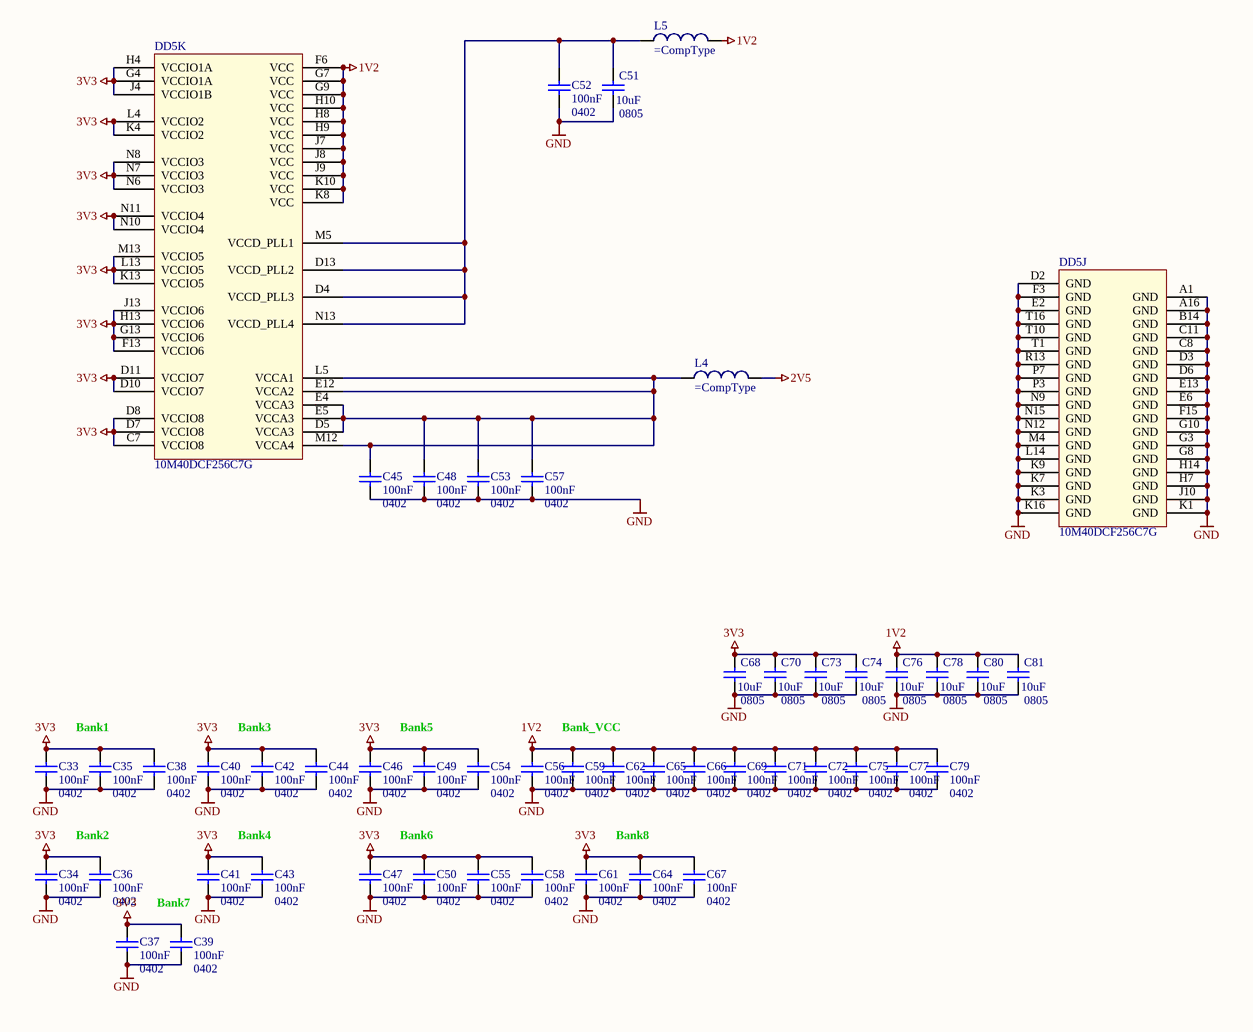
[diagram p3: S3_LED_MAT_FPGA_POWER.SchDoc]

### Parts
C33  value 100nF  Package: 0402  [CAPC1005L]  (hidden comment: 100nF / 0402 / X7R / 16V)
C34  value 100nF  Package: 0402  [CAPC1005L]  (hidden comment: 100nF / 0402 / X7R / 16V)
C35  value 100nF  Package: 0402  [CAPC1005L]  (hidden comment: 100nF / 0402 / X7R / 16V)
C36  value 100nF  Package: 0402  [CAPC1005L]  (hidden comment: 100nF / 0402 / X7R / 16V)
C37  value 100nF  Package: 0402  [CAPC1005L]  (hidden comment: 100nF / 0402 / X7R / 16V)
C38  value 100nF  Package: 0402  [CAPC1005L]  (hidden comment: 100nF / 0402 / X7R / 16V)
C39  value 100nF  Package: 0402  [CAPC1005L]  (hidden comment: 100nF / 0402 / X7R / 16V)
C40  value 100nF  Package: 0402  [CAPC1005L]  (hidden comment: 100nF / 0402 / X7R / 16V)
C41  value 100nF  Package: 0402  [CAPC1005L]  (hidden comment: 100nF / 0402 / X7R / 16V)
C42  value 100nF  Package: 0402  [CAPC1005L]  (hidden comment: 100nF / 0402 / X7R / 16V)
C43  value 100nF  Package: 0402  [CAPC1005L]  (hidden comment: 100nF / 0402 / X7R / 16V)
C44  value 100nF  Package: 0402  [CAPC1005L]  (hidden comment: 100nF / 0402 / X7R / 16V)
C45  value 100nF  Package: 0402  [CAPC1005L]  (hidden comment: 100nF / 0402 / X7R / 16V)
C46  value 100nF  Package: 0402  [CAPC1005L]  (hidden comment: 100nF / 0402 / X7R / 16V)
C47  value 100nF  Package: 0402  [CAPC1005L]  (hidden comment: 100nF / 0402 / X7R / 16V)
C48  value 100nF  Package: 0402  [CAPC1005L]  (hidden comment: 100nF / 0402 / X7R / 16V)
C49  value 100nF  Package: 0402  [CAPC1005L]  (hidden comment: 100nF / 0402 / X7R / 16V)
C50  value 100nF  Package: 0402  [CAPC1005L]  (hidden comment: 100nF / 0402 / X7R / 16V)
C51  value 10uF  Package: 0805  [CAPC2012L]  (hidden comment: 10uF / 0805 /  X5R / 10V)
C52  value 100nF  Package: 0402  [CAPC1005L]  (hidden comment: 100nF / 0402 / X7R / 16V)
C53  value 100nF  Package: 0402  [CAPC1005L]  (hidden comment: 100nF / 0402 / X7R / 16V)
C54  value 100nF  Package: 0402  [CAPC1005L]  (hidden comment: 100nF / 0402 / X7R / 16V)
C55  value 100nF  Package: 0402  [CAPC1005L]  (hidden comment: 100nF / 0402 / X7R / 16V)
C56  value 100nF  Package: 0402  [CAPC1005L]  (hidden comment: 100nF / 0402 / X7R / 16V)
C57  value 100nF  Package: 0402  [CAPC1005L]  (hidden comment: 100nF / 0402 / X7R / 16V)
C58  value 100nF  Package: 0402  [CAPC1005L]  (hidden comment: 100nF / 0402 / X7R / 16V)
C59  value 100nF  Package: 0402  [CAPC1005L]  (hidden comment: 100nF / 0402 / X7R / 16V)
C61  value 100nF  Package: 0402  [CAPC1005L]  (hidden comment: 100nF / 0402 / X7R / 16V)
C62  value 100nF  Package: 0402  [CAPC1005L]  (hidden comment: 100nF / 0402 / X7R / 16V)
C64  value 100nF  Package: 0402  [CAPC1005L]  (hidden comment: 100nF / 0402 / X7R / 16V)
C65  value 100nF  Package: 0402  [CAPC1005L]  (hidden comment: 100nF / 0402 / X7R / 16V)
C66  value 100nF  Package: 0402  [CAPC1005L]  (hidden comment: 100nF / 0402 / X7R / 16V)
C67  value 100nF  Package: 0402  [CAPC1005L]  (hidden comment: 100nF / 0402 / X7R / 16V)
C68  value 10uF  Package: 0805  [CAPC2012L]  (hidden comment: 10uF / 0805 /  X5R / 10V)
C69  value 100nF  Package: 0402  [CAPC1005L]  (hidden comment: 100nF / 0402 / X7R / 16V)
C70  value 10uF  Package: 0805  [CAPC2012L]  (hidden comment: 10uF / 0805 /  X5R / 10V)
C71  value 100nF  Package: 0402  [CAPC1005L]  (hidden comment: 100nF / 0402 / X7R / 16V)
C72  value 100nF  Package: 0402  [CAPC1005L]  (hidden comment: 100nF / 0402 / X7R / 16V)
C73  value 10uF  Package: 0805  [CAPC2012L]  (hidden comment: 10uF / 0805 /  X5R / 10V)
C74  value 10uF  Package: 0805  [CAPC2012L]  (hidden comment: 10uF / 0805 /  X5R / 10V)
C75  value 100nF  Package: 0402  [CAPC1005L]  (hidden comment: 100nF / 0402 / X7R / 16V)
C76  value 10uF  Package: 0805  [CAPC2012L]  (hidden comment: 10uF / 0805 /  X5R / 10V)
C77  value 100nF  Package: 0402  [CAPC1005L]  (hidden comment: 100nF / 0402 / X7R / 16V)
C78  value 10uF  Package: 0805  [CAPC2012L]  (hidden comment: 10uF / 0805 /  X5R / 10V)
C79  value 100nF  Package: 0402  [CAPC1005L]  (hidden comment: 100nF / 0402 / X7R / 16V)
C80  value 10uF  Package: 0805  [CAPC2012L]  (hidden comment: 10uF / 0805 /  X5R / 10V)
C81  value 10uF  Package: 0805  [CAPC2012L]  (hidden comment: 10uF / 0805 /  X5R / 10V)
DD5  10M40DCF256C7G  [BGA100P16X16-256]  (parts J,K of 11)
L4  (no value)  [INDC2012L]
L5  (no value)  [INDC2012L]

### Nets
1V2: C56.2 C59.2 C62.2 C65.2 C66.2 C69.2 C71.2 C72.2 C75.2 C76.2 C77.2 C78.2 C79.2 C80.2 C81.2 DD5.F6(VCC) DD5.G7(VCC) DD5.G9(VCC) DD5.H8(VCC) DD5.H9(VCC) DD5.H10(VCC) DD5.J7(VCC) DD5.J8(VCC) DD5.J9(VCC) DD5.K8(VCC) DD5.K10(VCC) L5.2
2V5: L4.2
3V3: C33.2 C34.2 C35.2 C36.2 C37.2 C38.2 C39.2 C40.2 C41.2 C42.2 C43.2 C44.2 C46.2 C47.2 C49.2 C50.2 C54.2 C55.2 C58.2 C61.2 C64.2 C67.2 C68.2 C70.2 C73.2 C74.2 DD5.C7(VCCIO8) DD5.D7(VCCIO8) DD5.D8(VCCIO8) DD5.D10(VCCIO7) DD5.D11(VCCIO7) DD5.F13(VCCIO6) DD5.G4(VCCIO1A) DD5.G13(VCCIO6) DD5.H4(VCCIO1A) DD5.H13(VCCIO6) DD5.J4(VCCIO1B) DD5.J13(VCCIO6) DD5.K4(VCCIO2) DD5.K13(VCCIO5) DD5.L4(VCCIO2) DD5.L13(VCCIO5) DD5.M13(VCCIO5) DD5.N6(VCCIO3) DD5.N7(VCCIO3) DD5.N8(VCCIO3) DD5.N10(VCCIO4) DD5.N11(VCCIO4)
GND: C33.1 C34.1 C35.1 C36.1 C37.1 C38.1 C39.1 C40.1 C41.1 C42.1 C43.1 C44.1 C45.1 C46.1 C47.1 C48.1 C49.1 C50.1 C51.1 C52.1 C53.1 C54.1 C55.1 C56.1 C57.1 C58.1 C59.1 C61.1 C62.1 C64.1 C65.1 C66.1 C67.1 C68.1 C69.1 C70.1 C71.1 C72.1 C73.1 C74.1 C75.1 C76.1 C77.1 C78.1 C79.1 C80.1 C81.1 DD5.A1(GND) DD5.A16(GND) DD5.B14(GND) DD5.C8(GND) DD5.C11(GND) DD5.D2(GND) DD5.D3(GND) DD5.D6(GND) DD5.E2(GND) DD5.E6(GND) DD5.E13(GND) DD5.F3(GND) DD5.F15(GND) DD5.G3(GND) DD5.G8(GND) DD5.G10(GND) DD5.H7(GND) DD5.H14(GND) DD5.J10(GND) DD5.K1(GND) DD5.K3(GND) DD5.K7(GND) DD5.K9(GND) DD5.K16(GND) DD5.L14(GND) DD5.M4(GND) DD5.N9(GND) DD5.N12(GND) DD5.N15(GND) DD5.P3(GND) DD5.P7(GND) DD5.R13(GND) DD5.T1(GND) DD5.T10(GND) DD5.T16(GND)
NetC45_2: C45.2 C48.2 C53.2 C57.2 DD5.D5(VCCA3) DD5.E4(VCCA3) DD5.E5(VCCA3) DD5.E12(VCCA2) DD5.L5(VCCA1) DD5.M12(VCCA4) L4.1
NetC51_2: C51.2 C52.2 DD5.D4(VCCD_PLL3) DD5.D13(VCCD_PLL2) DD5.M5(VCCD_PLL1) DD5.N13(VCCD_PLL4) L5.1

### Notes on the sheet
- Bank1
- Bank3
- Bank5
- Bank_VCC
- Bank2
- Bank4
- Bank6
- Bank8
- Bank7
- Title
- Size:
- Date:
- A3
- Number:
- Time:
- Revision:
- Sheet
- of
- File:

### Library data of the parts
C33-C50 C52-C59 C61 C62 C64-C67 C69 C71 C72 C75 C77 C79 = 100nF / 0402 / X7R / 16V: as C1 on sheet LED_MAT_HUB; Voltage: 16V; CompName: Capacitor; Price: 0.2
C51 C68 C70 C73 C74 C76 C78 C80 C81 = 10uF / 0805 /  X5R / 10V: Capacitor ceramic; Voltage: 10V; CompName: Capacitor; Price: 0.2
DD5 = 10M40DCF256C7G: as DD5 on sheet S3_LED_MAT_FPGA; CompType: 10M40DCF256C7G; ValueBOM: 10M40DCF256C7G; Package: BGA256; Price: 1800; Remarks: *; Supplier: ARROW
L4 L5 = INDUCTOR: Ferrite bead; Manufacturer: Murata; Manufacturer Part Number: BLM21PG221SN1; CompName: Inductor; Package: 0805; Price: 0.06

## Sheet S1_LED_MAT_HDMI.SCHDOC: HDMI Input
size A3; DrawnBy: KSN; Engineer: Dim Su; Revision: 2.0; SheetNumber: 2; SheetTotal: 7; ContentRev1: Original Document; dateREV1: "Aug/09/2018"; dateREV2: "Aug/31/2018"; ContentRev2: ESD circuit changed; Rev1: V1; Rev2: V2; Project: LED_MAT3
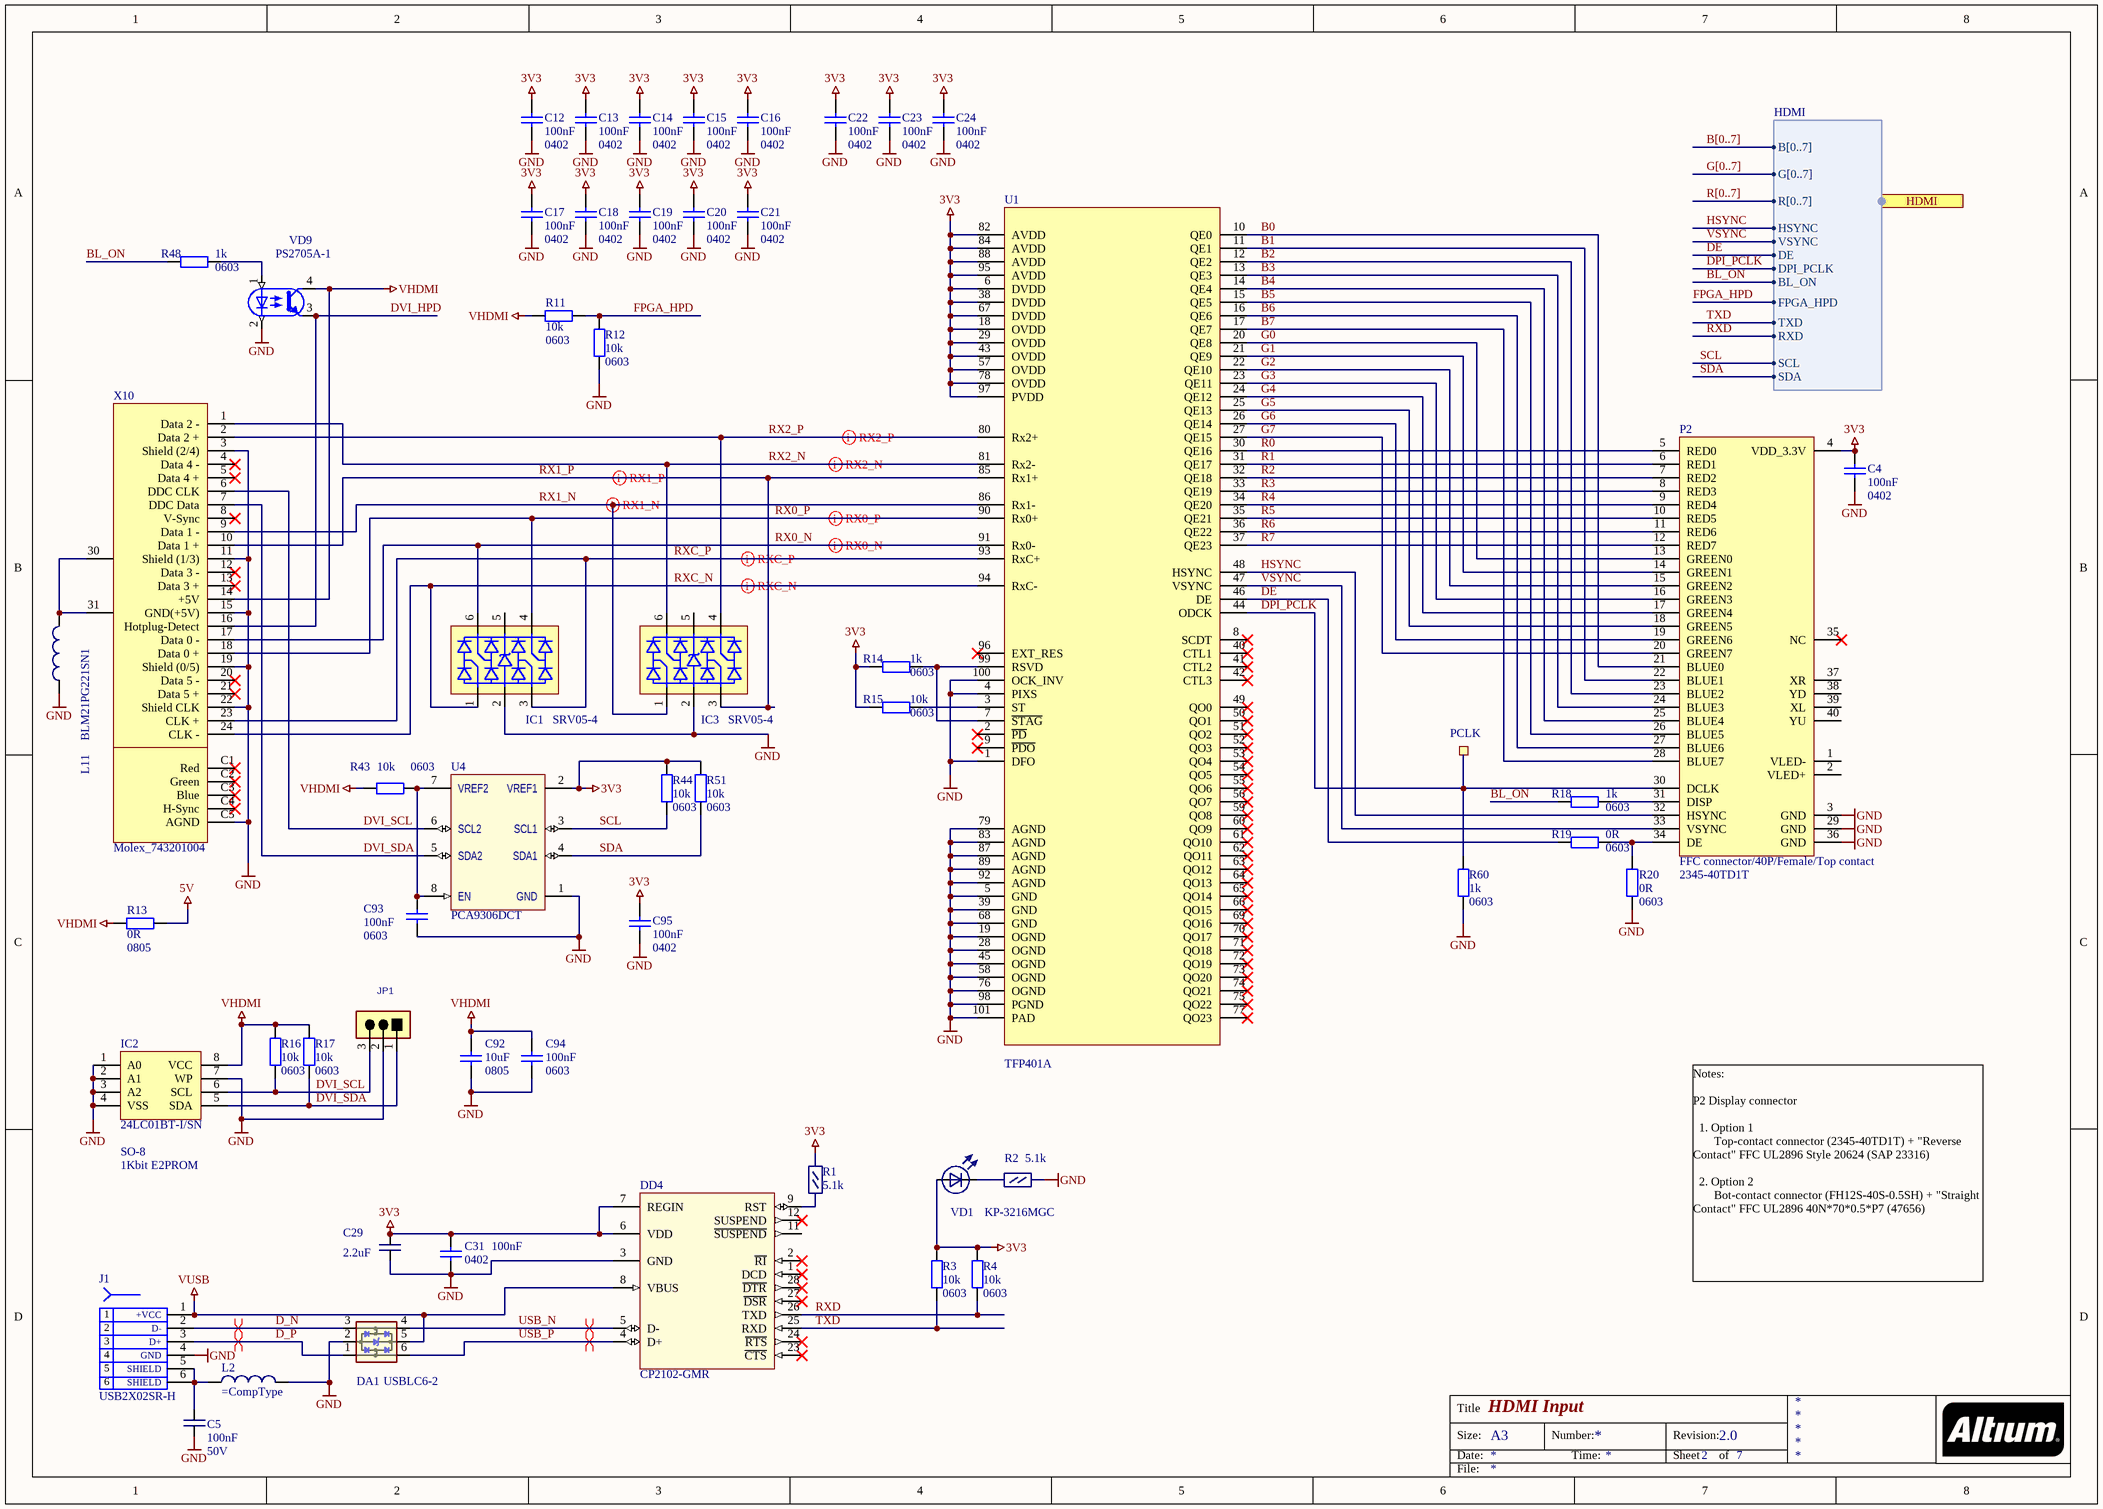
[diagram p4: S1_LED_MAT_HDMI.SCHDOC]

### Parts
C4  value 100nF  Package: 0402  [CAPC1005L]  (hidden comment: 100nF / 0402 / X7R / 16V)
C5  100nF  Voltage: 50V  [CAPC1608L]
C12  value 100nF  Package: 0402  [CAPC1005L]  (hidden comment: 100nF / 0402 / X7R / 16V)
C13  value 100nF  Package: 0402  [CAPC1005L]  (hidden comment: 100nF / 0402 / X7R / 16V)
C14  value 100nF  Package: 0402  [CAPC1005L]  (hidden comment: 100nF / 0402 / X7R / 16V)
C15  value 100nF  Package: 0402  [CAPC1005L]  (hidden comment: 100nF / 0402 / X7R / 16V)
C16  value 100nF  Package: 0402  [CAPC1005L]  (hidden comment: 100nF / 0402 / X7R / 16V)
C17  value 100nF  Package: 0402  [CAPC1005L]  (hidden comment: 100nF / 0402 / X7R / 16V)
C18  value 100nF  Package: 0402  [CAPC1005L]  (hidden comment: 100nF / 0402 / X7R / 16V)
C19  value 100nF  Package: 0402  [CAPC1005L]  (hidden comment: 100nF / 0402 / X7R / 16V)
C20  value 100nF  Package: 0402  [CAPC1005L]  (hidden comment: 100nF / 0402 / X7R / 16V)
C21  value 100nF  Package: 0402  [CAPC1005L]  (hidden comment: 100nF / 0402 / X7R / 16V)
C22  value 100nF  Package: 0402  [CAPC1005L]  (hidden comment: 100nF / 0402 / X7R / 16V)
C23  value 100nF  Package: 0402  [CAPC1005L]  (hidden comment: 100nF / 0402 / X7R / 16V)
C24  value 100nF  Package: 0402  [CAPC1005L]  (hidden comment: 100nF / 0402 / X7R / 16V)
C29  2.2uF  [CAPC2012L]
C31  value 100nF  Package: 0402  [CAPC1005L]  (hidden comment: 100nF / 0402 / X7R / 16V)
C92  value 10uF  Package: 0805  [CAPC2012L]  (hidden comment: 10uF / 0805 /  X5R / 10V)
C93  value 100nF  Package: 0603  [CAPC1608L]  (hidden comment: 100nF / 0603 / X7R / 16V)
C94  value 100nF  Package: 0603  [CAPC1608L]  (hidden comment: 100nF / 0603 / X7R / 16V)
C95  value 100nF  Package: 0402  [CAPC1005L]  (hidden comment: 100nF / 0402 / X7R / 16V)
DA1  USBLC6-2  [SOT95P280X110-6L]
DD4  CP2102-GMR  [QFN50P500X500-28V1N]
IC1  value SRV05-4  [SOT23-6 (DBV)]  (hidden comment: SRV05-4.TCT/5V/300W/TVS Diode Array)
IC2  value 1Kbit E2PROM  Manufacturer Part Number: 24LC01BT-I/SN  Package: SO-8  [SOIC127P600-8N]  (hidden comment: 24LC01B)
IC3  value SRV05-4  [SOT23-6 (DBV)]  (hidden comment: SRV05-4.TCT/5V/300W/TVS Diode Array)
J1  USB2X02SR-H  [USB_B]
JP1  Header 1x3, 2.54mm  [HDR-1x3 SAP 10347]  (value not drawn)
L2  (no value)  [INDC2012L]
L11  BLM21PG221SN1  [INDC2012L]
P2  value FFC connector/40P/Female/Top contact  Manufacturer Part Number: 2345-40TD1T  [OUPIN 2345-40]  (hidden comment: TIANMA_TM043NBH02)
PCLK  Ø1.0mm,SMD  [TP_SMD_1MM]  (value not drawn)  (no BOM)
R1  5.1k  [RESC1608L]
R2  5.1k  [RESC1608L]
R3  value 10k  Package: 0603  [RESC1608L]  (hidden comment: 10k / 1% / 0603 / TC100 / 50V / 0.1W)
R4  value 10k  Package: 0603  [RESC1608L]  (hidden comment: 10k / 1% / 0603 / TC100 / 50V / 0.1W)
R11  value 10k  Package: 0603  [RESC1608L]  (hidden comment: 10k / 1% / 0603 / TC100 / 50V / 0.1W)
R12  value 10k  Package: 0603  [RESC1608L]  (hidden comment: 10k / 1% / 0603 / TC100 / 50V / 0.1W)
R13  value 0R  Package: 0805  [RESC2012L]  (hidden comment: 0R / 2A / 0805/ TC100 / 50V / 0.125W)
R14  value 1k  Package: 0603  [RESC1608L]  (hidden comment: 1k / 1% / 0603 / TC100 / 50V / 0.1W)
R15  value 10k  Package: 0603  [RESC1608L]  (hidden comment: 10k / 1% / 0603 / TC100 / 50V / 0.1W)
R16  value 10k  Package: 0603  [RESC1608L]  (hidden comment: 10k / 1% / 0603 / TC100 / 50V / 0.1W)
R17  value 10k  Package: 0603  [RESC1608L]  (hidden comment: 10k / 1% / 0603 / TC100 / 50V / 0.1W)
R18  value 1k  Package: 0603  [RESC1608L]  (hidden comment: 1k / 1% / 0603 / TC100 / 50V / 0.1W)
R19  value 0R  Package: 0603  [RESC1608L]  (hidden comment: 0R / 1A / 0603 / TC100 / 50V / 0.1W)
R20  value 0R  Package: 0603  [RESC1608L]  (hidden comment: 0R / 1A / 0603 / TC100 / 50V / 0.1W)
R43  value 10k  Package: 0603  [RESC1608L]  (hidden comment: 10k / 1% / 0603 / TC100 / 50V / 0.1W)
R44  value 10k  Package: 0603  [RESC1608L]  (hidden comment: 10k / 1% / 0603 / TC100 / 50V / 0.1W)
R48  value 1k  Package: 0603  [RESC1608L]  (hidden comment: 1k / 1% / 0603 / TC100 / 50V / 0.1W)
R51  value 10k  Package: 0603  [RESC1608L]  (hidden comment: 10k / 1% / 0603 / TC100 / 50V / 0.1W)
R60  value 1k  Package: 0603  [RESC1608L]  (hidden comment: 1k / 1% / 0603 / TC100 / 50V / 0.1W)
U1  TFP401A  [100 LQFP (14x14)]
U4  PCA9306DCT  [TSSOP65-8L - DCT (R-PDSO-G8)]
VD1  KP-3216MGC  [LED3216X10L]
VD9  PS2705A-1  [PS2705A-1]
X10  Molex_743201004  [DVI 29pol / Female Insertion / 90°]

### Ports
HDMI (harness HDMI)

### Harnesses
HDMI: B[0..7], G[0..7], R[0..7], HSYNC, VSYNC, DE, DPI_PCLK, BL_ON, TXD, RXD, SCL, SDA, FPGA_HPD

### Nets
3V3: C4.2 C12.2 C13.2 C14.2 C15.2 C16.2 C17.2 C18.2 C19.2 C20.2 C21.2 C22.2 C23.2 C24.2 C29.1 C31.2 C95.2 DD4.6(VDD) DD4.7(REGIN) P2.4(VDD_3.3V) R1.1 R3.1 R4.1 R14.2 R15.1 R44.1 R51.1 U1.6(DVDD) U1.18(OVDD) U1.29(OVDD) U1.38(DVDD) U1.43(OVDD) U1.57(OVDD) U1.67(DVDD) U1.78(OVDD) U1.82(AVDD) U1.84(AVDD) U1.88(AVDD) U1.95(AVDD) U1.97(PVDD) U4.2(VREF1) VD1.1
5V: R13.1
GND: C4.1 C5.2 C12.1 C13.1 C14.1 C15.1 C16.1 C17.1 C18.1 C19.1 C20.1 C21.1 C22.1 C23.1 C24.1 C29.2 C31.1 C92.2 C93.1 C94.1 C95.1 DA1.2 DD4.3(GND) DD4.29(GND) IC1.2 IC2.1(A0) IC2.2(A1) IC2.3(A2) IC2.4(VSS) IC2.7(WP) IC3.2 J1.4(GND) JP1.2 L2.2 L11.1 P2.0(GND) P2.3(GND) P2.29(GND) P2.36(GND) R2.1 R12.2 R20.1 R60.2 U1.1(DFO) U1.4(PIXS) U1.5(GND) U1.19(OGND) U1.28(OGND) U1.39(GND) U1.45(OGND) U1.58(OGND) U1.68(GND) U1.76(OGND) U1.79(AGND) U1.83(AGND) U1.87(AGND) U1.89(AGND) U1.92(AGND) U1.98(PGND) U1.100(OCK_INV) U1.101(PAD) U4.1(GND) VD9.2(K) X10.3(Shield_(2/4)) X10.11(Shield_(1/3)) X10.15(GND(+5V)) X10.19(Shield_(0/5)) X10.22(Shield_CLK) X10.C5(AGND)
VHDMI: C92.1 C94.2 IC2.8(VCC) R11.1 R13.2 R16.1 R17.1 R43.1 VD9.4 X10.14(+5V)
VUSB: DA1.5 DD4.8(VBUS) J1.1(+VCC)
B0: P2.21(BLUE0) U1.10(QE0)
B1: P2.22(BLUE1) U1.11(QE1)
B2: P2.23(BLUE2) U1.12(QE2)
B3: P2.24(BLUE3) U1.13(QE3)
B4: P2.25(BLUE4) U1.14(QE4)
B5: P2.26(BLUE5) U1.15(QE5)
B6: P2.27(BLUE6) U1.16(QE6)
B7: P2.28(BLUE7) U1.17(QE7)
BL_ON: R18.2 R48.2 ; port HDMI.BL_ON
D_N: DA1.3 J1.2(D-)
D_P: DA1.1 J1.3(D+)
DE: R19.1 U1.46(DE) ; port HDMI.DE
DPI_PCLK: P2.30(DCLK) PCLK.1 R60.1 U1.44(ODCK) ; port HDMI.DPI_PCLK
DVI_HPD: VD9.3 X10.16(Hotplug-Detect)
DVI_SCL: IC2.6(SCL) JP1.3 R16.2 U4.6(SCL2) X10.6(DDC_CLK)
DVI_SDA: IC2.5(SDA) JP1.1 R17.2 U4.5(SDA2) X10.7(DDC_Data)
FPGA_HPD: R11.2 R12.1 ; port HDMI.FPGA_HPD
G0: P2.13(GREEN0) U1.20(QE8)
G1: P2.14(GREEN1) U1.21(QE9)
G2: P2.15(GREEN2) U1.22(QE10)
G3: P2.16(GREEN3) U1.23(QE11)
G4: P2.17(GREEN4) U1.24(QE12)
G5: P2.18(GREEN5) U1.25(QE13)
G6: P2.19(GREEN6) U1.26(QE14)
G7: P2.20(GREEN7) U1.27(QE15)
HSYNC: P2.32(HSYNC) U1.48(HSYNC) ; port HDMI.HSYNC
R0: P2.5(RED0) U1.30(QE16)
R1: P2.6(RED1) U1.31(QE17)
R2: P2.7(RED2) U1.32(QE18)
R3: P2.8(RED3) U1.33(QE19)
R4: P2.9(RED4) U1.34(QE20)
R5: P2.10(RED5) U1.35(QE21)
R6: P2.11(RED6) U1.36(QE22)
R7: P2.12(RED7) U1.37(QE23)
RX0_N: IC1.6 U1.91(Rx0-) X10.17(Data_0_-)
RX0_P: IC1.4 U1.90(Rx0+) X10.18(Data_0_+)
RX1_N: IC3.1(VCC) U1.86(Rx1-) X10.9(Data_1_-)
RX1_P: IC3.3 U1.85(Rx1+) X10.10(Data_1_+)
RX2_N: IC3.6 U1.81(Rx2-) X10.1(Data_2_-)
RX2_P: IC3.4 U1.80(Rx2+) X10.2(Data_2_+)
RXC_N: IC1.1(VCC) U1.94(RxC-) X10.24(CLK_-)
RXC_P: IC1.3 U1.93(RxC+) X10.23(CLK_+)
RXD: DD4.26(TXD) R4.2 ; port HDMI.RXD
SCL: R44.2 U4.3(SCL1) ; port HDMI.SCL
SDA: R51.2 U4.4(SDA1) ; port HDMI.SDA
TXD: DD4.25(RXD) R3.2 ; port HDMI.TXD
USB_N: DA1.4 DD4.5(D-)
USB_P: DA1.6 DD4.4(D+)
VSYNC: P2.33(VSYNC) U1.47(VSYNC) ; port HDMI.VSYNC
NetC5_1: C5.1 J1.5(SHIELD) J1.6(SHIELD) L2.1
NetC93_2: C93.2 R43.2 U4.7(VREF2) U4.8(EN)
NetDD4_9: DD4.9(RST) R1.2
NetL11_2: L11.2 X10.30 X10.31
NetP2_31: P2.31(DISP) R18.1
NetP2_34: P2.34(DE) R19.2 R20.2
NetR2_2: R2.2 VD1.2
NetR14_1: R14.1 U1.7(~{STAG}) U1.99(RSVD)
NetR15_2: R15.2 U1.3(ST)
NetR48_1: R48.1 VD9.1(A)

Not connected (* = marked no-connect by the designer): DD4 1(DCD)* 2(~{RI})* 10(NC) 11(~{SUSPEND}) 12(SUSPEND)* 13(NC) 14(NC) 15(NC) 16(NC) 17(NC) 18(NC) 19(NC) 20(NC) 21(NC) 22(NC) 23(~{CTS})* 24(~{RTS})* 27(~{DSR})* 28(~{DTR})*; IC1 5; IC3 5; P2 1(VLED-) 2(VLED+) 35(NC)* 37(XR) 38(YD) 39(XL) 40(YU); U1 2(~{PD})* 8(SCDT)* 9(~{PDO})* 40(CTL1)* 41(CTL2)* 42(CTL3)* 49(QO0)* 50(QO1)* 51(QO2)* 52(QO3)* 53(QO4)* 54(QO5)* 55(QO6)* 56(QO7)* 59(QO8)* 60(QO9)* 61(QO10)* 62(QO11)* 63(QO12)* 64(QO13)* 65(QO14)* 66(QO15)* 69(QO16)* 70(QO17)* 71(QO18)* 72(QO19)* 73(QO20)* 74(QO21)* 75(QO22)* 77(QO23)* 96(EXT_RES)*; X10 4(Data_4_-)* 5(Data_4_+)* 8(V-Sync)* 12(Data_3_-)* 13(Data_3_+)* 20(Data_5_-)* 21(Data_5_+)* C1(Red)* C2(Green)* C3(Blue)* C4(H-Sync)*

### Buses and harness runs
bus B[0..7]
bus G[0..7]
bus R[0..7]

### Layout directives
differential pair: RX0_N, RX0_P, RX1_N, RX1_P, RX2_N, RX2_P, RXC_N, RXC_P
differential pair; net class Diff_90Ohm: D_N, D_P, USB_N, USB_P

### Notes on the sheet
- Notes:
  P2 Display connector
  1. Option 1
  Top-contact connector (2345-40TD1T) + "Reverse Contact" FFC UL2896 Style 20624 (SAP 23316)
  2. Option 2
  Bot-contact connector (FH12S-40S-0.5SH) + "Straight Contact" FFC UL2896 40N*70*0.5*P7 (47656)
- Title
- Size:
- Date:
- A3
- Number:
- Time:
- Revision:
- Sheet
- of
- File:

### Library data of the parts
C4 C12-C24 C31 C95 = 100nF / 0402 / X7R / 16V: as C1 on sheet LED_MAT_HUB; Voltage: 16V; CompName: Capacitor; Price: 0.2
C5 = Capacitor CC0805 100nF C0G: Capacitor SMD; Manufacturer: SAMSUNG; Manufacturer Part Number: CL21B104KBCNNNC; Tolerance: 5%; CompName: Capacitor; Value: 100nF; Package: 0805; Price: 0.07
C29 = Capacitor CC0805 2.2uF X7R: Capacitor SMD; Manufacturer: TDK; Manufacturer Part Number: C2012X7R1C225K125AB; Voltage: 50V; Tolerance: 20%; CompName: Capacitor; Value: 2.2uF; Package: 0805; Price: 0.63
C92 = 10uF / 0805 /  X5R / 10V: Capacitor ceramic; Voltage: 10V; CompName: Capacitor; Price: 0.2
C93 C94 = 100nF / 0603 / X7R / 16V: Capacitor ceramic; Manufacturer: *; Manufacturer Part Number: *; Voltage: 16V; CompName: Capacitor; Price: 0.2
DA1 = EMC_USBLC6-2SC6: Very low capacitance ESD protection; CompName: IC; Manufacturer: ST; Value: USBLC6-2; Manufacturer Part Number: USBLC6-2SC6; Price: 20
DD4 = CP2102-GM: USB to UART bridge; CompName: IC; Manufacturer: SILICON; Manufacturer Part Number: CP2102-GMR; Package: QFN28; Price: 2; Value: CP2102-GMR
IC1 IC3 = SRV05-4.TCT/5V/300W/TVS Diode Array: Low Capacitance Transient Voltage   Suppressors Diode Array; Manufacturer: SEMTECH; Voltage: 5V; Remarks: ./.; Manufacturer Part Number: SRV05-4.TCT; Temperature: -55°C ~ 125°C; Category: Diode; Price: 9.79; Supplier: Digikey; Supplier Order Code: SRV05-4TR-ND; Package: SOT23-6L
IC2 = 24LC01B: 1K I2C Serial EEPROM; Manufacturer: MICROCHIP; CompName: IC; Temperature: -40ฐC - 85ฐC; Price: 3.21
J1 = CON6_LEFT: USB-B; CompName: Connector; Manufacturer: AUK; Manufacturer Part Number: USB2X02SR-H; Package: USB-B; Price: 3.14; Value: USB2X02SR-H
JP1 = HDR-1x3: Header, 3-Pin; Manufacturer Part Number: 21B1264-03S10-01G-6/3; Manufacturer: JIH VEI; CompName: Connector; Remarks: replaceable; Tolerance: ./.; Category: Header; Package: Header 1x3, 2.54mm; Price: 0.125; Temperature: -40...+85°C; Type: Header 1x3, 2.54mm; Value: Header 1x3, 2.54mm; Voltage: ./.
L2 = INDUCTOR: as L4 on sheet S3_LED_MAT_FPGA_POWER; CompName: Inductor; Package: 0805; Price: 0.06
L11 = L0805_BLM21: Ferrite bead; CompName: Inductor; Manufacturer: Murata; Manufacturer Part Number: BLM21PG221SN1; Package: 0805; Price: 0.06
P2 = TIANMA_TM043NBH02: Manufacturer: OUPIIN; CompName: Connector; Price: 1
PCLK = TESTPAD_SMD: circular SMD testpad 1mm; Manufacturer Part Number: *; Value: Ø1.0mm,SMD; Supplier: *; Category: Pattern
R1 R2 = Resistor RC0805 5k1: Resistor SMD; Manufacturer: YAGEO; Manufacturer Part Number: RC0805FR075K1L; Tolerance: 5%; CompName: Resistor; Value: 5.1k; Package: 0805; Price: 0.07
R3 R4 R11 R12 R15-R17 R43 R44 R51 = 10k / 1% / 0603 / TC100 / 50V / 0.1W: Resistor; Tolerance: 1%; Voltage: 50V; CompName: Resistor; Price: 0.02
R13 = 0R / 2A / 0805/ TC100 / 50V / 0.125W: Resistor; Manufacturer: YAGEO; Manufacturer Part Number: RC0805JR-070RL; Remarks: replaceable; Voltage: 50V; CompName: Resistor; Price: 0.02
R14 R18 R48 R60 = 1k / 1% / 0603 / TC100 / 50V / 0.1W: Resistor; Remarks: replaceable; Tolerance: 1%; Voltage: 50V; CompName: Resistor; Price: 0.02
R19 R20 = 0R / 1A / 0603 / TC100 / 50V / 0.1W: Resistor; Manufacturer: YAGEO; Manufacturer Part Number: RC0603FR-070RL; Remarks: replaceable; Voltage: 50V; CompName: Resistor; Price: 0.02
U1 = TFP401A_2: PanelBus DVI Receiver 165MHz, HSYNC fix; Manufacturer: TI; CompName: IC; Package: TQFP-100; Manufacturer Part Number: TFP401A; Price: 7.02
U4 = PCA9306DCTT: Bidirectional Translator; CompName: IC; Manufacturer: TI; Manufacturer Part Number: PCA9306DCT; Package: TSOP-8; Price: 22.5; Type: IC; Value: PCA9306DCT
VD1 = KP-3216MGC: SMD LED GREEN; Manufacturer: KINGBRIGHT; CompName: LED; Manufacturer Part Number: KP-3216MGC; Package: 3216; Price: 3.5; Type: Green
VD9 = PS2701A-1: Photocoupler, SOP package; CompName: IC; Manufacturer: RENESAS; Manufacturer Part Number: PS2705A-1-F3-A; CompKind: 0; Value: PS2705A-1-F3-A; CompType: PS2705A-1; ValueBOM: PS2705A-1; Package: SOP-4; Price: 4.16
X10 = DVI / 29pole / 90°: DVI Connector; Manufacturer: AMTEK; Manufacturer Part Number: DVIR-F29SWND-L; Value: Molex_743201004; Package: DVI / 29pole / 90°; CompName: Connector; Price: 1